# EAGLE design Launch Shield (EAGLE 6.5.0)
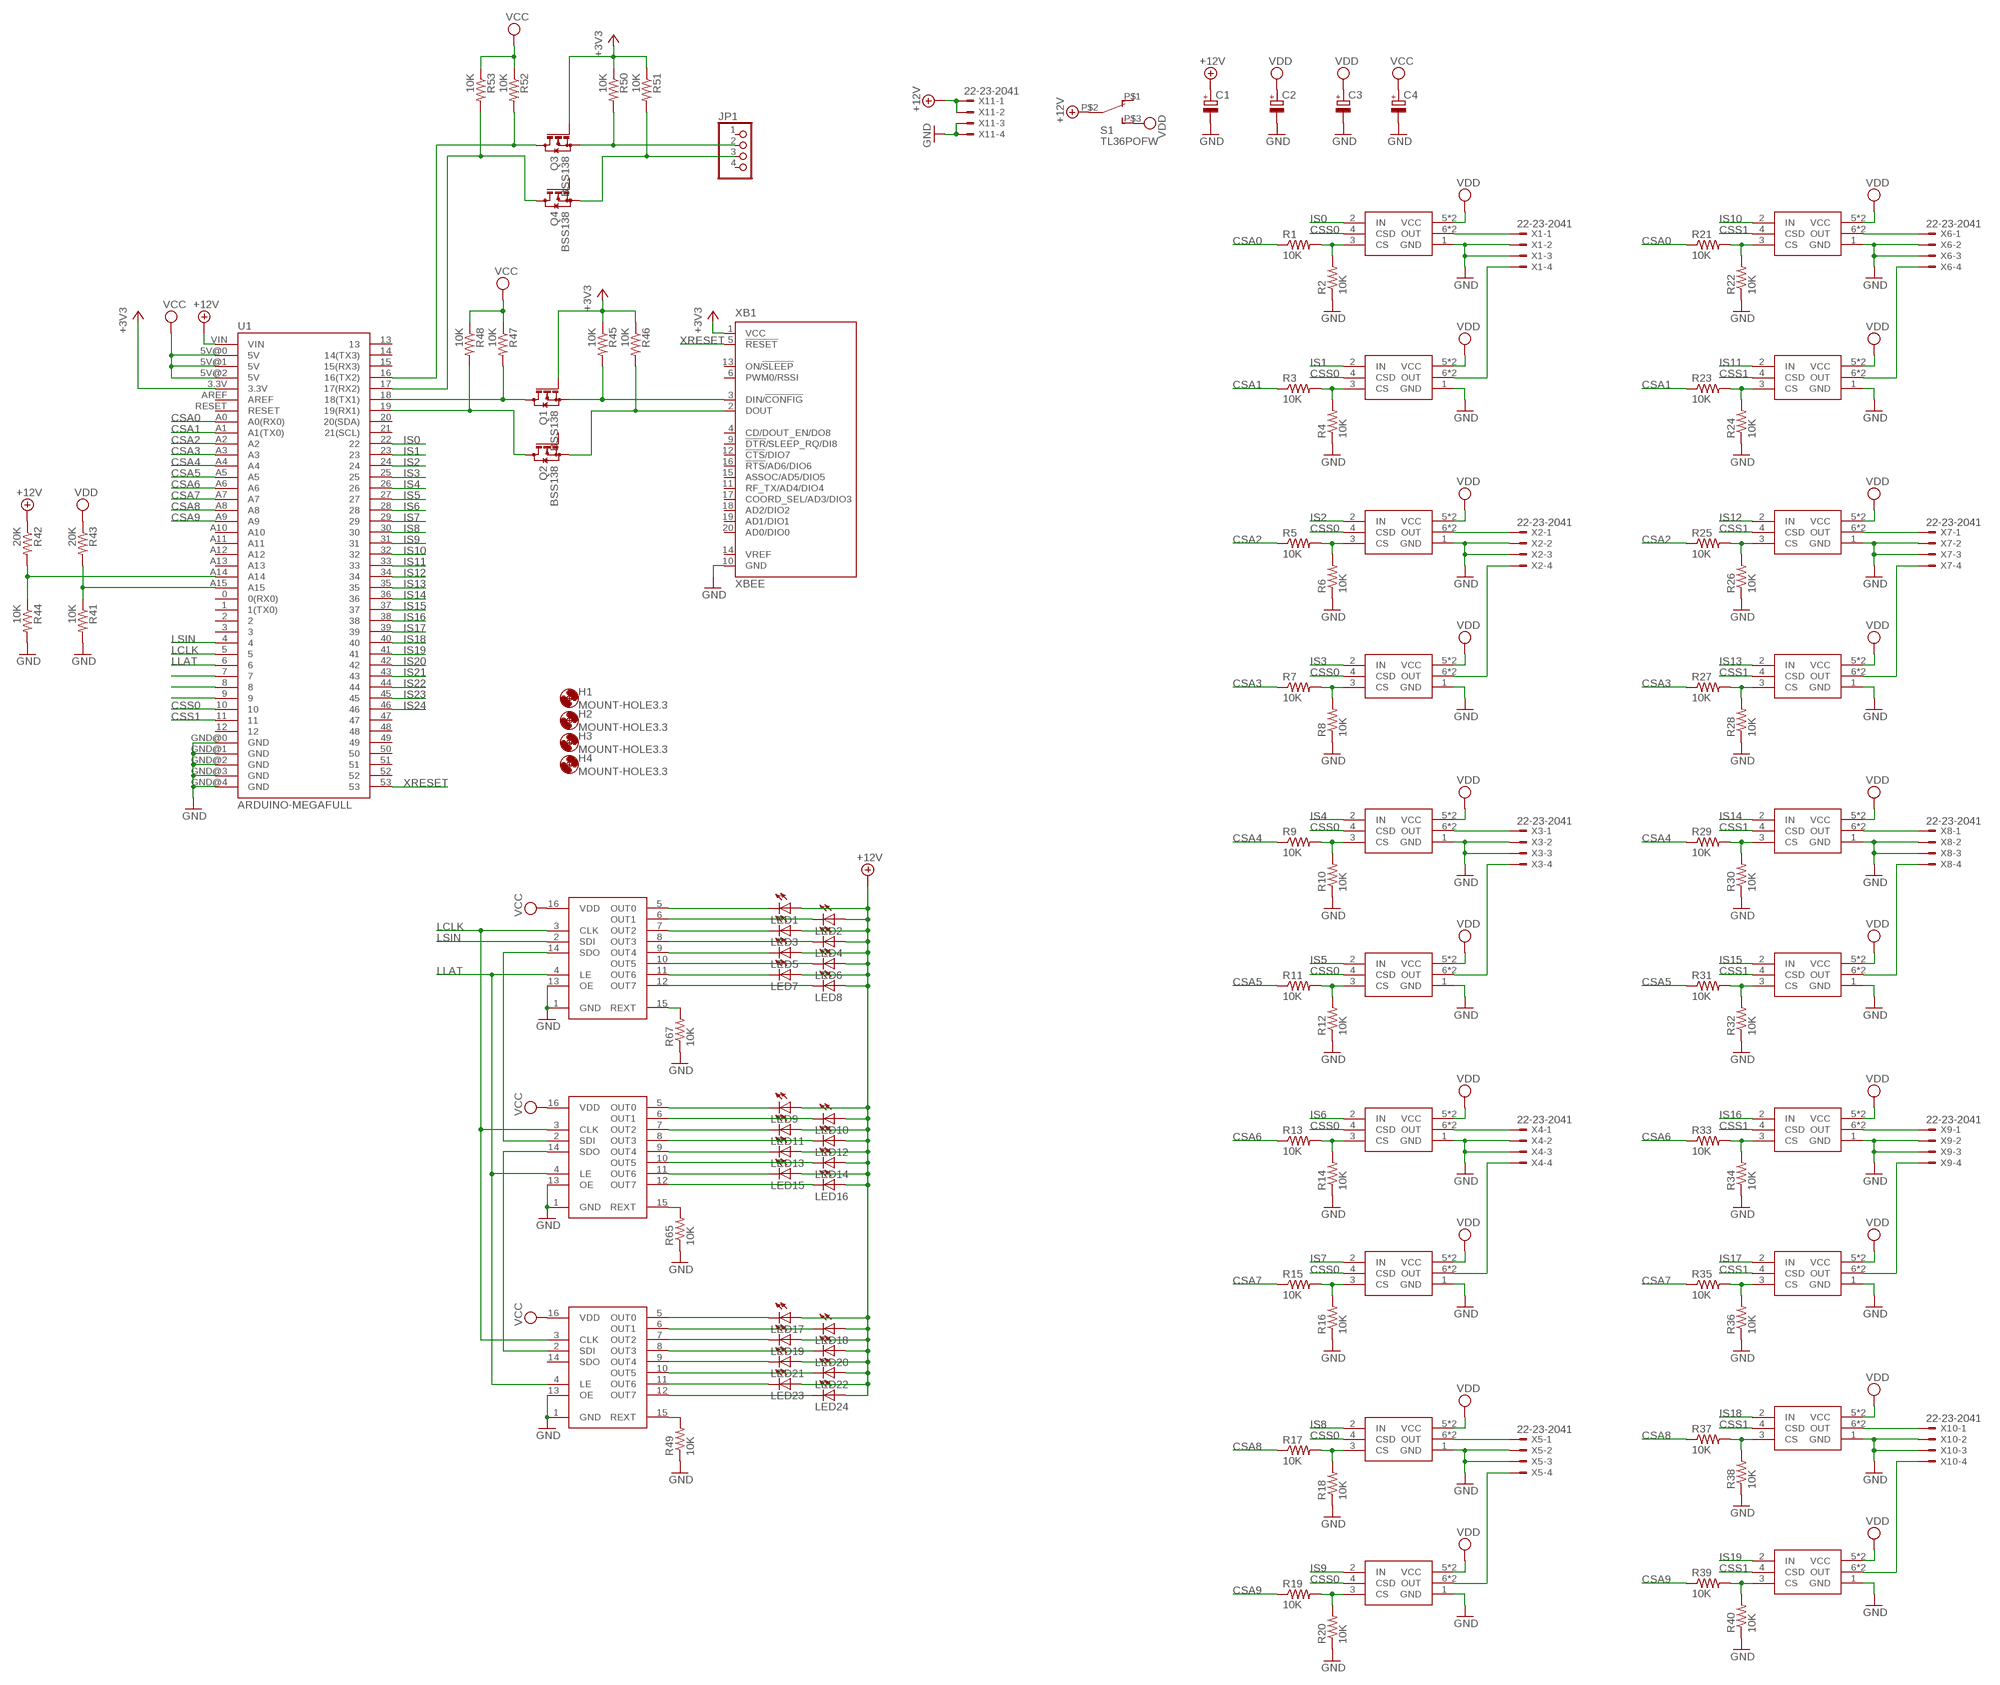
[diagram p0: schematic, sheet 1]

## Parts
C1  CPOL-EUE5-6  [E5-6]
C2  CPOL-EUE5-6  [E5-6]
C3  CPOL-EUE5-6  [E5-6]
C4  CPOL-EUE5-6  [E5-6]
H1  MOUNT-HOLE3.3  [3,3]
H2  MOUNT-HOLE3.3  [3,3]
H3  MOUNT-HOLE3.3  [3,3]
H4  MOUNT-HOLE3.3  [3,3]
JP1  PINHD-1X4  [1X04]
LED1  LEDCHIPLED_0805  [CHIPLED_0805]
LED2  LEDCHIPLED_0805  [CHIPLED_0805]
LED3  LEDCHIPLED_0805  [CHIPLED_0805]
LED4  LEDCHIPLED_0805  [CHIPLED_0805]
LED5  LEDCHIPLED_0805  [CHIPLED_0805]
LED6  LEDCHIPLED_0805  [CHIPLED_0805]
LED7  LEDCHIPLED_0805  [CHIPLED_0805]
LED8  LEDCHIPLED_0805  [CHIPLED_0805]
LED9  LEDCHIPLED_0805  [CHIPLED_0805]
LED10  LEDCHIPLED_0805  [CHIPLED_0805]
LED11  LEDCHIPLED_0805  [CHIPLED_0805]
LED12  LEDCHIPLED_0805  [CHIPLED_0805]
LED13  LEDCHIPLED_0805  [CHIPLED_0805]
LED14  LEDCHIPLED_0805  [CHIPLED_0805]
LED15  LEDCHIPLED_0805  [CHIPLED_0805]
LED16  LEDCHIPLED_0805  [CHIPLED_0805]
LED17  LEDCHIPLED_0805  [CHIPLED_0805]
LED18  LEDCHIPLED_0805  [CHIPLED_0805]
LED19  LEDCHIPLED_0805  [CHIPLED_0805]
LED20  LEDCHIPLED_0805  [CHIPLED_0805]
LED21  LEDCHIPLED_0805  [CHIPLED_0805]
LED22  LEDCHIPLED_0805  [CHIPLED_0805]
LED23  LEDCHIPLED_0805  [CHIPLED_0805]
LED24  LEDCHIPLED_0805  [CHIPLED_0805]
Q1  BSS138  BSS123  [SOT23]
Q2  BSS138  BSS123  [SOT23]
Q3  BSS138  BSS123  [SOT23]
Q4  BSS138  BSS123  [SOT23]
R1  10K  R-US_R0603  [R0603]
R2  10K  R-US_R0603  [R0603]
R3  10K  R-US_R0603  [R0603]
R4  10K  R-US_R0603  [R0603]
R5  10K  R-US_R0603  [R0603]
R6  10K  R-US_R0603  [R0603]
R7  10K  R-US_R0603  [R0603]
R8  10K  R-US_R0603  [R0603]
R9  10K  R-US_R0603  [R0603]
R10  10K  R-US_R0603  [R0603]
R11  10K  R-US_R0603  [R0603]
R12  10K  R-US_R0603  [R0603]
R13  10K  R-US_R0603  [R0603]
R14  10K  R-US_R0603  [R0603]
R15  10K  R-US_R0603  [R0603]
R16  10K  R-US_R0603  [R0603]
R17  10K  R-US_R0603  [R0603]
R18  10K  R-US_R0603  [R0603]
R19  10K  R-US_R0603  [R0603]
R20  10K  R-US_R0603  [R0603]
R21  10K  R-US_R0603  [R0603]
R22  10K  R-US_R0603  [R0603]
R23  10K  R-US_R0603  [R0603]
R24  10K  R-US_R0603  [R0603]
R25  10K  R-US_R0603  [R0603]
R26  10K  R-US_R0603  [R0603]
R27  10K  R-US_R0603  [R0603]
R28  10K  R-US_R0603  [R0603]
R29  10K  R-US_R0603  [R0603]
R30  10K  R-US_R0603  [R0603]
R31  10K  R-US_R0603  [R0603]
R32  10K  R-US_R0603  [R0603]
R33  10K  R-US_R0603  [R0603]
R34  10K  R-US_R0603  [R0603]
R35  10K  R-US_R0603  [R0603]
R36  10K  R-US_R0603  [R0603]
R37  10K  R-US_R0603  [R0603]
R38  10K  R-US_R0603  [R0603]
R39  10K  R-US_R0603  [R0603]
R40  10K  R-US_R0603  [R0603]
R41  10K  R-US_R0603  [R0603]
R42  20K  R-US_R0603  [R0603]
R43  20K  R-US_R0603  [R0603]
R44  10K  R-US_R0603  [R0603]
R45  10K  R-US_R0603  [R0603]
R46  10K  R-US_R0603  [R0603]
R47  10K  R-US_R0603  [R0603]
R48  10K  R-US_R0603  [R0603]
R49  10K  R-US_R0603  [R0603]
R50  10K  R-US_R0603  [R0603]
R51  10K  R-US_R0603  [R0603]
R52  10K  R-US_R0603  [R0603]
R53  10K  R-US_R0603  [R0603]
R65  10K  R-US_R0603  [R0603]
R67  10K  R-US_R0603  [R0603]
S1  TL36POFW  [TOGGLE]
U1  ARDUINO-MEGAFULL  [ARDUINO_MEGA]
U$1  VN5E160MS-E  [SOIC8]
U$2  VN5E160MS-E  [SOIC8]
U$3  VN5E160MS-E  [SOIC8]
U$4  VN5E160MS-E  [SOIC8]
U$5  VN5E160MS-E  [SOIC8]
U$6  VN5E160MS-E  [SOIC8]
U$7  VN5E160MS-E  [SOIC8]
U$8  VN5E160MS-E  [SOIC8]
U$9  VN5E160MS-E  [SOIC8]
U$10  VN5E160MS-E  [SOIC8]
U$11  VN5E160MS-E  [SOIC8]
U$12  VN5E160MS-E  [SOIC8]
U$13  VN5E160MS-E  [SOIC8]
U$14  VN5E160MS-E  [SOIC8]
U$15  VN5E160MS-E  [SOIC8]
U$16  VN5E160MS-E  [SOIC8]
U$17  VN5E160MS-E  [SOIC8]
U$18  VN5E160MS-E  [SOIC8]
U$19  VN5E160MS-E  [SOIC8]
U$20  VN5E160MS-E  [SOIC8]
U$21  TLC5916  [D_R-PDSO-G16]
U$22  TLC5916  [D_R-PDSO-G16]
U$23  TLC5916  [D_R-PDSO-G16]
X1  22-23-2041  [22-23-2041]
X2  22-23-2041  [22-23-2041]
X3  22-23-2041  [22-23-2041]
X4  22-23-2041  [22-23-2041]
X5  22-23-2041  [22-23-2041]
X6  22-23-2041  [22-23-2041]
X7  22-23-2041  [22-23-2041]
X8  22-23-2041  [22-23-2041]
X9  22-23-2041  [22-23-2041]
X10  22-23-2041  [22-23-2041]
X11  22-23-2041  [22-23-2041]
XB1  XBEE  [XBEE]

## Nets
+3V3: Q1.1(G) Q3.1(G) R45.1 R46.1 R50.1 R51.1 U1.3.3V XB1.1(VCC)
+12V: C1.+ LED1.A LED2.A LED3.A LED4.A LED5.A LED6.A LED7.A LED8.A LED9.A LED10.A LED11.A LED12.A LED13.A LED14.A LED15.A LED16.A LED17.A LED18.A LED19.A LED20.A LED21.A LED22.A LED23.A LED24.A R42.1 S1.P$2(P) U1.VIN X11.1 X11.2
CSA0: R1.1 R21.1 U1.A0(A0(RX0))
CSA1: R3.1 R23.1 U1.A1(A1(TX0))
CSA2: R5.1 R25.1 U1.A2
CSA3: R7.1 R27.1 U1.A3
CSA4: R9.1 R29.1 U1.A4
CSA5: R11.1 R31.1 U1.A5
CSA6: R13.1 R33.1 U1.A6
CSA7: R15.1 R35.1 U1.A7
CSA8: R17.1 R37.1 U1.A8
CSA9: R19.1 R39.1 U1.A9
CSS0: U1.10 U$1.4(CSD) U$2.4(CSD) U$3.4(CSD) U$4.4(CSD) U$5.4(CSD) U$6.4(CSD) U$7.4(CSD) U$8.4(CSD) U$9.4(CSD) U$10.4(CSD)
CSS1: U1.11 U$11.4(CSD) U$12.4(CSD) U$13.4(CSD) U$14.4(CSD) U$15.4(CSD) U$16.4(CSD) U$17.4(CSD) U$18.4(CSD) U$19.4(CSD) U$20.4(CSD)
GND: C1.- C2.- C3.- C4.- R2.1 R4.1 R6.1 R8.1 R10.1 R12.1 R14.1 R16.1 R18.1 R20.1 R22.1 R24.1 R26.1 R28.1 R30.1 R32.1 R34.1 R36.1 R38.1 R40.1 R41.2 R44.2 R49.1 R65.1 R67.1 U1.GND@0(GND) U1.GND@1(GND) U1.GND@2(GND) U1.GND@3(GND) U1.GND@4(GND) U$1.1(GND) U$2.1(GND) U$3.1(GND) U$4.1(GND) U$5.1(GND) U$6.1(GND) U$7.1(GND) U$8.1(GND) U$9.1(GND) U$10.1(GND) U$11.1(GND) U$12.1(GND) U$13.1(GND) U$14.1(GND) U$15.1(GND) U$16.1(GND) U$17.1(GND) U$18.1(GND) U$19.1(GND) U$20.1(GND) U$21.1(GND) U$21.13(OE) U$22.1(GND) U$22.13(OE) U$23.1(GND) U$23.13(OE) X1.2 X1.3 X2.2 X2.3 X3.2 X3.3 X4.2 X4.3 X5.2 X5.3 X6.2 X6.3 X7.2 X7.3 X8.2 X8.3 X9.2 X9.3 X10.2 X10.3 X11.3 X11.4 XB1.10(GND)
IS0: U1.22 U$1.2(IN)
IS1: U1.23 U$2.2(IN)
IS2: U1.24 U$3.2(IN)
IS3: U1.25 U$4.2(IN)
IS4: U1.26 U$5.2(IN)
IS5: U1.27 U$6.2(IN)
IS6: U1.28 U$7.2(IN)
IS7: U1.29 U$8.2(IN)
IS8: U1.30 U$9.2(IN)
IS9: U1.31 U$10.2(IN)
IS10: U1.32 U$11.2(IN)
IS11: U1.33 U$12.2(IN)
IS12: U1.34 U$13.2(IN)
IS13: U1.35 U$14.2(IN)
IS14: U1.36 U$15.2(IN)
IS15: U1.37 U$16.2(IN)
IS16: U1.38 U$17.2(IN)
IS17: U1.39 U$18.2(IN)
IS18: U1.40 U$19.2(IN)
IS19: U1.41 U$20.2(IN)
IS20: U1.42
IS21: U1.43
IS22: U1.44
IS23: U1.45
IS24: U1.46
LCLK: U1.5 U$21.3(CLK) U$22.3(CLK) U$23.3(CLK)
LLAT: U1.6 U$21.4(LE) U$22.4(LE) U$23.4(LE)
LSIN: U1.4 U$21.2(SDI)
N$1: U$1.6(OUT) U$1.7(OUT) X1.1
N$2: R1.2 R2.2 U$1.3(CS)
N$3: R3.2 R4.2 U$2.3(CS)
N$4: U$2.6(OUT) U$2.7(OUT) X1.4
N$5: R5.2 R6.2 U$3.3(CS)
N$6: U$10.6(OUT) U$10.7(OUT) X5.4
N$7: R7.2 R8.2 U$4.3(CS)
N$8: U$4.6(OUT) U$4.7(OUT) X2.4
N$9: R9.2 R10.2 U$5.3(CS)
N$10: U$5.6(OUT) U$5.7(OUT) X3.1
N$11: R11.2 R12.2 U$6.3(CS)
N$12: U$11.6(OUT) U$11.7(OUT) X6.1
N$13: R13.2 R14.2 U$7.3(CS)
N$14: U$12.6(OUT) U$12.7(OUT) X6.4
N$15: R15.2 R16.2 U$8.3(CS)
N$16: U$18.6(OUT) U$18.7(OUT) X9.4
N$17: R17.2 R18.2 U$9.3(CS)
N$18: R42.2 R44.1 U1.A14
N$19: R19.2 R20.2 U$10.3(CS)
N$20: R41.1 R43.2 U1.A15
N$21: R21.2 R22.2 U$11.3(CS)
N$22: Q2.2(S) R46.2 XB1.2(DOUT)
N$23: R23.2 R24.2 U$12.3(CS)
N$24: Q1.2(S) R45.2 XB1.3(DIN/!CONFIG)
N$25: R25.2 R26.2 U$13.3(CS)
N$26: U$13.6(OUT) U$13.7(OUT) X7.1
N$27: R27.2 R28.2 U$14.3(CS)
N$28: R49.2 U$23.15(REXT)
N$29: R29.2 R30.2 U$15.3(CS)
N$30: U$15.6(OUT) U$15.7(OUT) X8.1
N$31: R31.2 R32.2 U$16.3(CS)
N$32: U$14.6(OUT) U$14.7(OUT) X7.4
N$33: R33.2 R34.2 U$17.3(CS)
N$34: U$17.6(OUT) U$17.7(OUT) X9.1
N$35: R35.2 R36.2 U$18.3(CS)
N$36: Q1.3(D) R47.2 U1.18(18(TX1))
N$37: R37.2 R38.2 U$19.3(CS)
N$38: U$19.6(OUT) U$19.7(OUT) X10.1
N$39: R39.2 R40.2 U$20.3(CS)
N$40: U$16.6(OUT) U$16.7(OUT) X8.4
N$41: Q2.3(D) R48.2 U1.19(19(RX1))
N$42: R65.2 U$22.15(REXT)
N$43: R67.2 U$21.15(REXT)
N$44: U$3.6(OUT) U$3.7(OUT) X2.1
N$45: U$21.14(SDO) U$22.2(SDI)
N$46: U$22.14(SDO) U$23.2(SDI)
N$47: LED8.C U$21.12(OUT7)
N$48: LED7.C U$21.11(OUT6)
N$49: U$6.6(OUT) U$6.7(OUT) X3.4
N$50: LED6.C U$21.10(OUT5)
N$51: U$20.6(OUT) U$20.7(OUT) X10.4
N$52: U$7.6(OUT) U$7.7(OUT) X4.1
N$53: U$8.6(OUT) U$8.7(OUT) X4.4
N$54: U$9.6(OUT) U$9.7(OUT) X5.1
N$55: LED5.C U$21.9(OUT4)
N$56: LED4.C U$21.8(OUT3)
N$57: LED3.C U$21.7(OUT2)
N$58: LED2.C U$21.6(OUT1)
N$59: LED1.C U$21.5(OUT0)
N$60: LED9.C U$22.5(OUT0)
N$61: LED10.C U$22.6(OUT1)
N$62: LED11.C U$22.7(OUT2)
N$63: LED12.C U$22.8(OUT3)
N$64: LED13.C U$22.9(OUT4)
N$65: U1.7
N$66: U1.8
N$67: U1.9
N$68: LED14.C U$22.10(OUT5)
N$69: LED15.C U$22.11(OUT6)
N$70: LED16.C U$22.12(OUT7)
N$71: LED17.C U$23.5(OUT0)
N$72: LED18.C U$23.6(OUT1)
N$73: LED19.C U$23.7(OUT2)
N$74: LED20.C U$23.8(OUT3)
N$75: LED21.C U$23.9(OUT4)
N$76: LED22.C U$23.10(OUT5)
N$77: LED23.C U$23.11(OUT6)
N$78: LED24.C U$23.12(OUT7)
N$79: JP1.3 Q4.2(S) R51.2
N$80: JP1.2 Q3.2(S) R50.2
N$81: Q3.3(D) R52.2 U1.16(16(TX2))
N$82: Q4.3(D) R53.2 U1.17(17(RX2))
VCC: C4.+ R47.1 R48.1 R52.1 R53.1 U1.5V@0(5V) U1.5V@1(5V) U1.5V@2(5V) U$21.16(VDD) U$22.16(VDD) U$23.16(VDD)
VDD: C2.+ C3.+ R43.1 S1.P$3(S) U$1.5(VCC) U$1.8(VCC) U$2.5(VCC) U$2.8(VCC) U$3.5(VCC) U$3.8(VCC) U$4.5(VCC) U$4.8(VCC) U$5.5(VCC) U$5.8(VCC) U$6.5(VCC) U$6.8(VCC) U$7.5(VCC) U$7.8(VCC) U$8.5(VCC) U$8.8(VCC) U$9.5(VCC) U$9.8(VCC) U$10.5(VCC) U$10.8(VCC) U$11.5(VCC) U$11.8(VCC) U$12.5(VCC) U$12.8(VCC) U$13.5(VCC) U$13.8(VCC) U$14.5(VCC) U$14.8(VCC) U$15.5(VCC) U$15.8(VCC) U$16.5(VCC) U$16.8(VCC) U$17.5(VCC) U$17.8(VCC) U$18.5(VCC) U$18.8(VCC) U$19.5(VCC) U$19.8(VCC) U$20.5(VCC) U$20.8(VCC)
XRESET: U1.53 XB1.5(!RESET)
Unconnected: JP1.1 JP1.4 Q2.1(G) Q4.1(G) S1.P$1(O) U1.0(0(RX0)) U1.1(1(TX0)) U1.2 U1.3 U1.12 U1.13 U1.14(14(TX3)) U1.15(15(RX3)) U1.20(20(SDA)) U1.21(21(SCL)) U1.47 U1.48 U1.49 U1.50 U1.51 U1.52 U1.A10 U1.A11 U1.A12 U1.A13 U1.AREF U1.RESET U$23.14(SDO) XB1.4(CD/DOUT_EN/DO8) XB1.6(PWM0/RSSI) XB1.9(!DTR!/SLEEP_RQ/DI8) XB1.11(RF_TX/AD4/DIO4) XB1.12(!CTS!/DIO7) XB1.13(ON/!SLEEP) XB1.14(VREF) XB1.15(ASSOC/AD5/DIO5) XB1.16(!RTS!/AD6/DIO6) XB1.17(COORD_SEL/AD3/DIO3) XB1.18(AD2/DIO2) XB1.19(AD1/DIO1) XB1.20(AD0/DIO0)

## Library data of the parts
C1-C4 = rcl:CPOL-EU: POLARIZED CAPACITOR, European symbol
H1-H4 = holes:MOUNT-HOLE: MOUNTING HOLE with drill center marker
JP1 = pinhead:PINHD-1X4: PIN HEADER
LED1-LED24 = led:LED: LED OSRAM: - CHIPLED LG R971, LG N971, LY N971, LG Q971, LY Q971, LO R971, LY R971 LH N974, LH R974 LS Q976, LO Q976, LY Q976 LO Q996 - Hyper CHIPLED LW Q18S LB Q993, LB Q99A, LB R99A - SideLED LS A670, LO A670, LY A670, LG A670, LP A670 LB A673, LV A673, LT A673, LW A673 LH A674 LY A675 LS A676, LA A676, LO A676, LY A676, LW A676 LS A679, LY A679, LG A679 - Hyper Micro SIDELED® LS Y876, LA Y876, LO Y876, LY Y876 LT Y87S - SmartLED LW L88C, LW L88S LB L89C, LB L89S, LG L890 LS L89K, LO L89K, LY L89K LS L896, LA L896, LO L896, LY L896 - TOPLED LS T670, LO T670, LY T670, LG T670, LP T670 LSG T670, LSP T670, LSY T670, LOP T670, LYG T670 LG T671, LOG T671, LSG T671 LB T673, LV T673, LT T673, LW T673 LH T674 LS T676, LA T676, LO T676, LY T676, LB T676, LH T676, LSB T676, LW T676 LB T67C, LV T67C, LT T67C, LS T67K, LO T67K, LY T67K, LW E67C LS E67B, LA E67B, LO E67B, LY E67B, LB E67C, LV E67C, LT E67C LW T67C LS T679, LY T679, LG T679 LS T770, LO T770, LY T770, LG T770, LP T770 LB T773, LV T773, LT T773, LW T773 LH T774 LS E675, LA E675, LY E675, LS T675 LS T776, LA T776, LO T776, LY T776, LB T776 LHGB T686 LT T68C, LB T68C - Hyper Mini TOPLED® LB M676 - Mini TOPLED Santana® LG M470 LS M47K, LO M47K, LY M47K Source: http://www.osram.convergy.de LUXEON: - LUMILED® LXK2-PW12-R00, LXK2-PW12-S00, LXK2-PW14-U00, LXK2-PW14-V00 LXK2-PM12-R00, LXK2-PM12-S00, LXK2-PM14-U00 LXK2-PE12-Q00, LXK2-PE12-R00, LXK2-PE12-S00, LXK2-PE14-T00, LXK2-PE14-U00 LXK2-PB12-K00, LXK2-PB12-L00, LXK2-PB12-M00, LXK2-PB14-N00, LXK2-PB14-P00, LXK2-PB14-Q00 LXK2-PR12-L00, LXK2-PR12-M00, LXK2-PR14-Q00, LXK2-PR14-R00 LXK2-PD12-Q00, LXK2-PD12-R00, LXK2-PD12-S00 LXK2-PH12-R00, LXK2-PH12-S00 LXK2-PL12-P00, LXK2-PL12-Q00, LXK2-PL12-R00 Source: www.luxeon.com KINGBRIGHT: KA-3528ASYC Source: www.kingbright.com
Q1-Q4 = transistor-small-signal:BSS123: N-CHANNEL MOS FET
R1-R53 R65 R67 = resistor:R-US_: RESISTOR, American symbol
S1 = chris:TL36PO: TINY SWITCH ON - ON Source: http://www2.produktinfo.conrad.com/datenblaetter/700000-724999/705152-da-01-de-Subminiaturschalter_TL_36YO.pdf
U1 = SparkFun-Boards:ARDUINO-MEGA: Arduino Mega board footprint
U$1-U$20 = chris:VN5E160MS-E
U$21-U$23 = chris:TLC5916
X1-X11 = con-molex:22-23-2041: .100" (2.54mm) Center Header - 4 Pin; MF: MOLEX; MPN: 22-23-2041; OC_FARNELL: 1462920; OC_NEWARK: 38C0355
XB1 = maxstream:XBEE: XBee (TM) /XBee-PRO(TM) OEM RF Modules Source: MaxStream, Inc. xbee_productmanual.pdf; MPN: XBP24-Z7UIT-004; OC_FARNELL: 1751799; OC_NEWARK: 34R5507

## Board
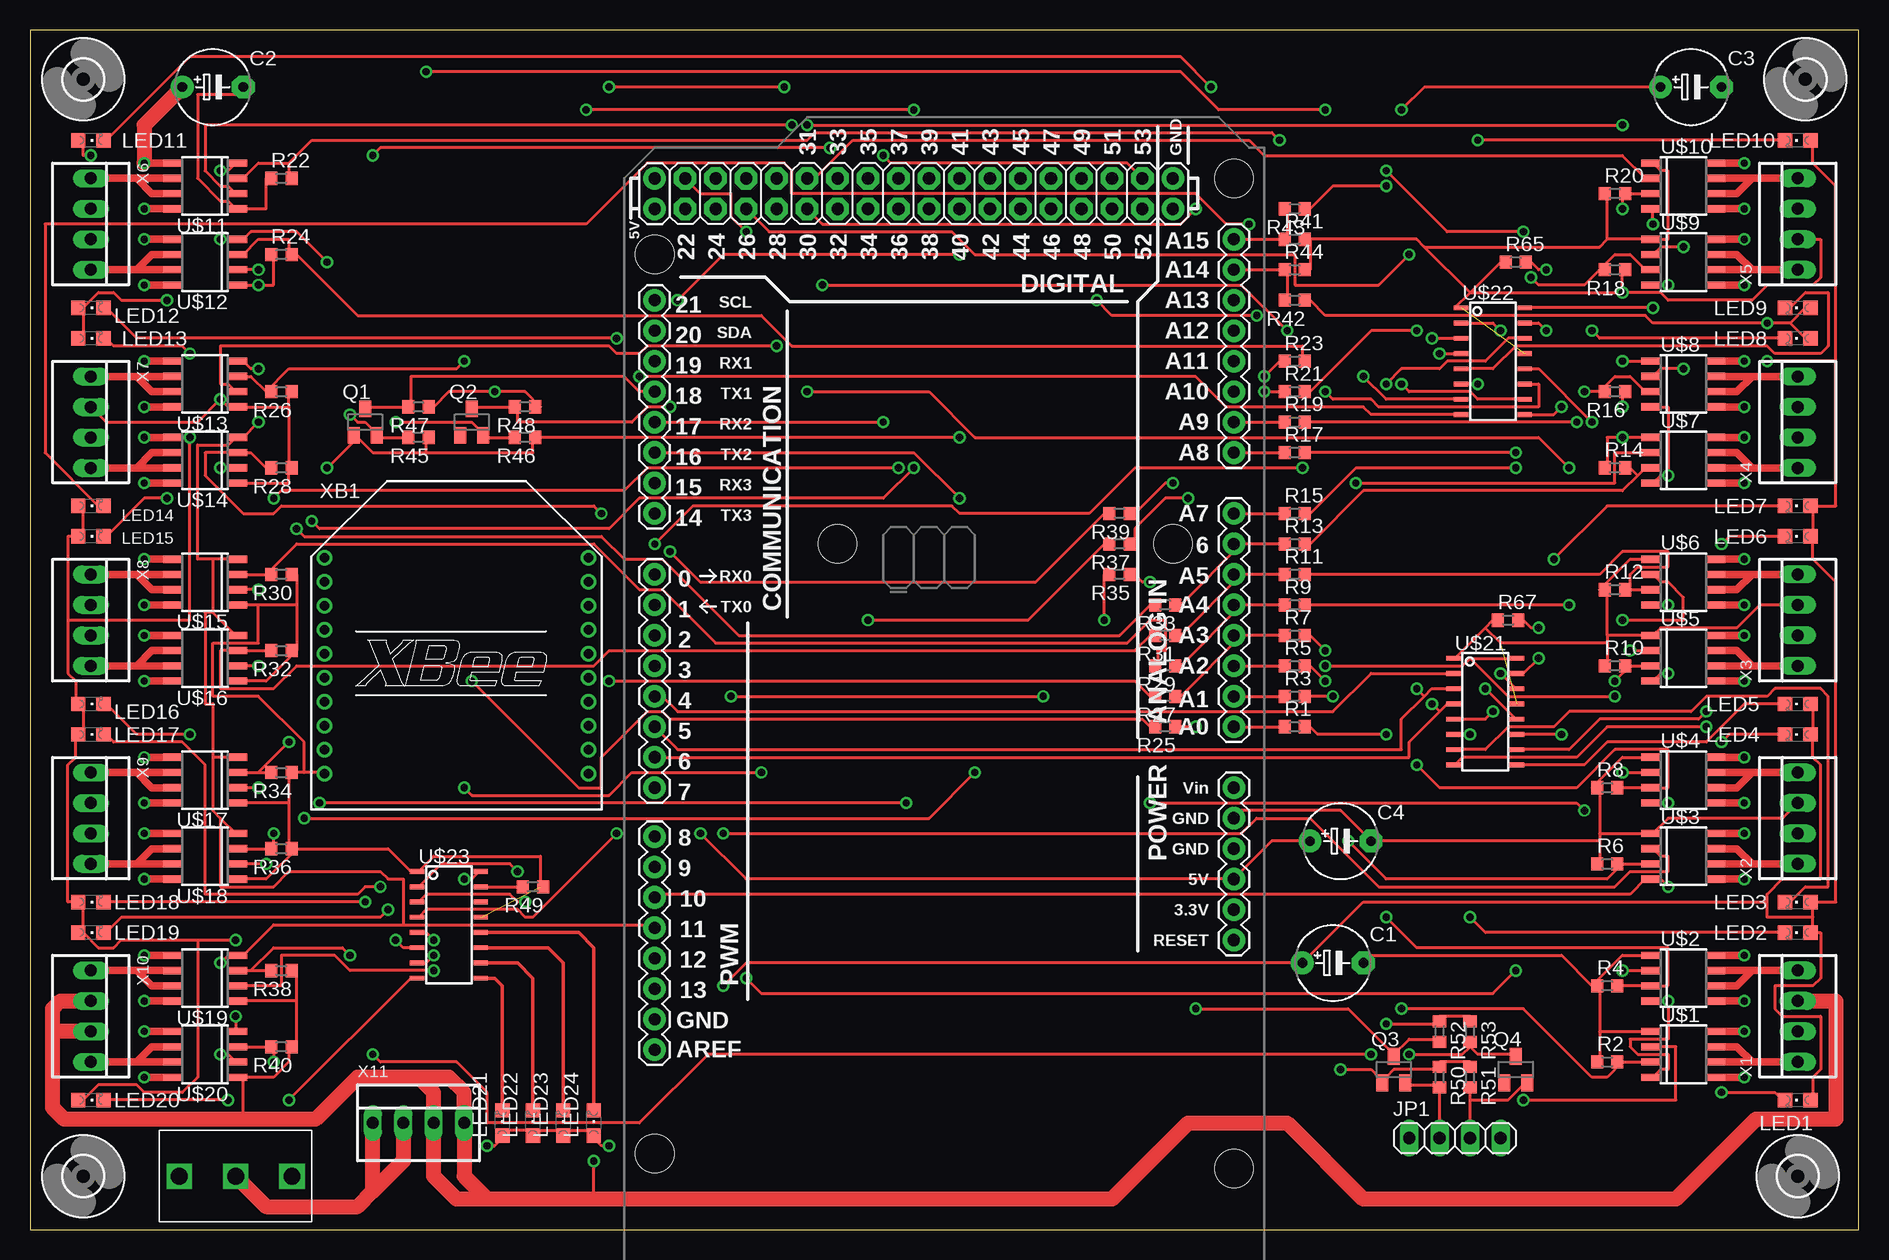
[diagram p1: board, top side]
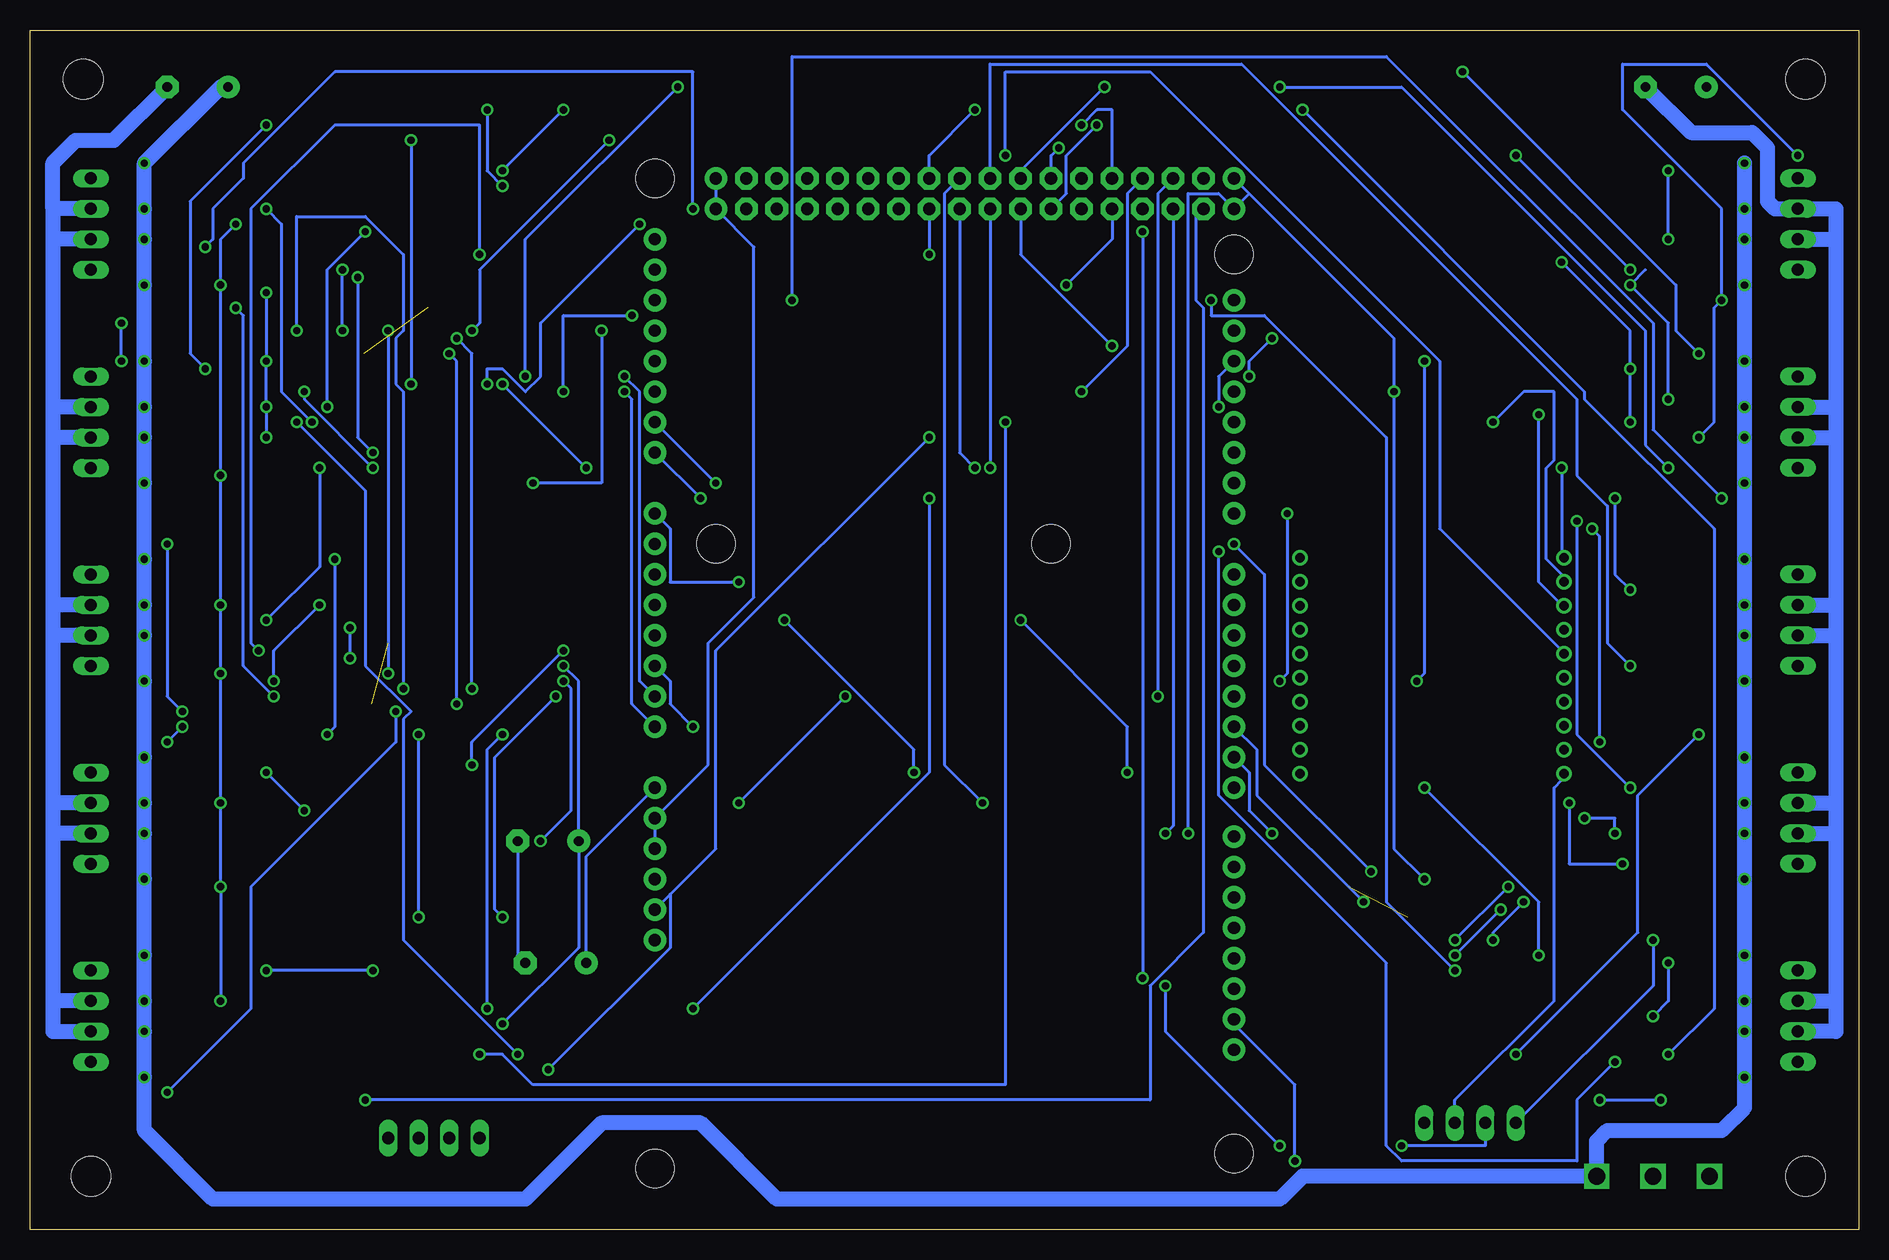
[diagram p2: board, bottom side, seen from below]

Size 152.39 x 100 mm. Coordinates in mm from the lower left corner, seen from the top.
Outline: 152.39,0 152.39,100 0,100 0,0 152.39,0
Copper layers (1*16): Top 0.035mm / dielectric 1.5mm / Bottom 0.035mm
Design rules "default": minimum track width 10mil, minimum drill 24mil, track to track 8mil, track to pad 8mil, pad to pad 8mil, via to via 8mil, smd to smd 8mil, copper to edge 40mil, drill to drill 8mil, minimum pad ring 10mil, minimum via ring 8mil, stop-mask expansion 4mil, vias tented up to drill 0mil, thermal gap 10mil

### Footprints (pad centres in the part's own frame; a part is rotated, then mirrored left to right if it is on the bottom)
E5-6 = drill 0.813 pad 1.905: + -2.54,0 | drill 0.813 pad 1.905 octagon: - 2.54,0
3,3 = hole 3.3: 0,0
1X04 = drill 1.016 long: 1 -3.81,0; 2 -1.27,0; 3 1.27,0; 4 3.81,0
CHIPLED_0805 = smd 1.2 x 1.2: A 0,-1.05; C 0,1.05
SOT23 = smd 1 x 1.4: 1 -0.95,-1.1; 2 0.95,-1.1; 3 0,1.1
R0603 = smd 1 x 1.1: 1 -0.85,0; 2 0.85,0
TOGGLE = drill 1.397 square: P$1 -4.699,0; P$2 0,0; P$3 4.699,0
ARDUINO_MEGA = drill 1.016 pad 1.88: 0 63.5,50.8; 1 60.96,50.8; 2 58.42,50.8; 3 55.88,50.8; 3.3V 35.56,2.54; 4 53.34,50.8; 5 50.8,50.8; 5V@0 38.1,2.54; 5V@1 93.98,50.8; 5V@2 96.52,50.8; 6 48.26,50.8; 7 45.72,50.8; 8 41.656,50.8; 9 39.116,50.8; 10 36.576,50.8; 11 34.036,50.8; 12 31.496,50.8; 13 28.956,50.8; 14 68.58,50.8; 15 71.12,50.8; 16 73.66,50.8; 17 76.2,50.8; 18 78.74,50.8; 19 81.28,50.8; 20 83.82,50.8; 21 86.36,50.8; A0 50.8,2.54; A1 53.34,2.54; A2 55.88,2.54; A3 58.42,2.54; A4 60.96,2.54; A5 63.5,2.54; A6 66.04,2.54; A7 68.58,2.54; A8 73.66,2.54; A9 76.2,2.54; A10 78.74,2.54; A11 81.28,2.54; A12 83.82,2.54; A13 86.36,2.54; A14 88.9,2.54; A15 91.44,2.54; AREF 23.876,50.8; GND@0 40.64,2.54; GND@1 43.18,2.54; GND@2 93.98,7.62; GND@3 96.52,7.62; GND@4 26.416,50.8; RESET 33.02,2.54; VIN 45.72,2.54 | drill 1.016 pad 1.88 octagon: 22 93.98,48.26; 23 96.52,48.26; 24 93.98,45.72; 25 96.52,45.72; 26 93.98,43.18; 27 96.52,43.18; 28 93.98,40.64; 29 96.52,40.64; 30 93.98,38.1; 31 96.52,38.1; 32 93.98,35.56; 33 96.52,35.56; 34 93.98,33.02; 35 96.52,33.02; 36 93.98,30.48; 37 96.52,30.48; 38 93.98,27.94; 39 96.52,27.94; 40 93.98,25.4; 41 96.52,25.4; 42 93.98,22.86; 43 96.52,22.86; 44 93.98,20.32; 45 96.52,20.32; 46 93.98,17.78; 47 96.52,17.78; 48 93.98,15.24; 49 96.52,15.24; 50 93.98,12.7; 51 96.52,12.7; 52 93.98,10.16; 53 96.52,10.16 | hole 3.2: 15.24,50.8; 13.97,2.54; 66.04,35.56; 66.04,7.62; 90.17,50.8; 96.52,2.54
SOIC8 = smd 0.6 x 1.5: 1 -1.905,-2.75; 2 -0.635,-2.75; 3 0.635,-2.75; 4 1.905,-2.75; 5 1.905,2.75; 6 0.635,2.75; 7 -0.635,2.75; 8 -1.905,2.75
D_R-PDSO-G16 = smd 0.4 x 1.2: 1 -4.445,-2.65; 2 -3.175,-2.65; 3 -1.905,-2.65; 4 -0.635,-2.65; 5 0.635,-2.65; 6 1.905,-2.65; 7 3.175,-2.65; 8 4.445,-2.65; 9 4.445,2.65; 10 3.175,2.65; 11 1.905,2.65; 12 0.635,2.65; 13 -0.635,2.65; 14 -1.905,2.65; 15 -3.175,2.65; 16 -4.445,2.65
22-23-2041 = drill 1 long: 1 -3.81,0; 2 -1.27,0; 3 1.27,0; 4 3.81,0
XBEE = drill 0.8 pad 1.27: 1 -11,9; 2 -11,7; 3 -11,5; 4 -11,3; 5 -11,1; 6 -11,-1; 7 -11,-3; 8 -11,-5; 9 -11,-7; 10 -11,-9; 11 11,-9; 12 11,-7; 13 11,-5; 14 11,-3; 15 11,-1; 16 11,1; 17 11,3; 18 11,5; 19 11,7; 20 11,9

### Placement (x,y rotation side)
C1  108.57,22.23 0 top
C2  15.23,95.25 0 top
C3  138.42,95.25 0 top
C4  109.21,32.38 0 top
H1  4.44,95.89 0 top
H2  4.44,4.45 0 top
H3  147.31,4.45 0 top
H4  147.95,95.89 0 top
JP1  118.73,7.62 0 top
LED1  147.31,10.79 90 top
LED2  147.31,24.77 90 top
LED3  147.31,27.3 90 top
LED4  147.31,41.27 90 top
LED5  147.31,43.81 90 top
LED6  147.31,57.78 90 top
LED7  147.31,60.33 90 top
LED8  147.31,74.3 90 top
LED9  147.31,76.83 90 top
LED10  147.31,90.81 90 top
LED11  5.07,90.81 270 top
LED12  5.07,76.83 270 top
LED13  5.07,74.3 270 top
LED14  5.07,60.33 270 top
LED15  5.07,57.78 270 top
LED16  5.07,43.81 270 top
LED17  5.07,41.27 270 top
LED18  5.07,27.3 270 top
LED19  5.07,24.77 270 top
LED20  5.07,10.79 270 top
LED21  39.36,8.89 0 top
LED22  41.9,8.89 0 top
LED23  44.44,8.89 0 top
LED24  46.98,8.89 0 top
Q1  27.93,67.31 0 top
Q2  36.82,67.31 0 top
Q3  113.66,13.34 0 top
Q4  123.81,13.34 0 top
R1  105.4,41.91 0 top
R2  131.44,13.97 0 top
R3  105.4,44.45 0 top
R4  131.44,20.32 0 top
R5  105.4,46.99 0 top
R6  131.44,30.48 0 top
R7  105.4,49.53 0 top
R8  131.44,36.83 0 top
R9  105.4,52.07 0 top
R10  132.07,46.99 0 top
R11  105.4,54.61 0 top
R12  132.07,53.34 0 top
R13  105.4,57.15 0 top
R14  132.07,63.5 0 top
R15  105.4,59.69 0 top
R16  132.07,69.85 180 top
R17  105.4,64.77 0 top
R18  132.07,80.01 180 top
R19  105.4,67.31 0 top
R20  132.07,86.36 0 top
R21  105.4,69.85 0 top
R22  20.94,87.63 0 top
R23  105.4,72.39 0 top
R24  20.94,81.28 0 top
R25  94.6,41.91 180 top
R26  20.94,69.85 180 top
R27  94.6,44.45 180 top
R28  20.94,63.5 180 top
R29  94.6,46.99 180 top
R30  20.94,54.61 180 top
R31  94.6,49.53 180 top
R32  20.94,48.26 180 top
R33  94.6,52.07 180 top
R34  20.94,38.1 180 top
R35  90.8,54.61 180 top
R36  20.94,31.75 180 top
R37  90.8,57.15 180 top
R38  20.94,21.59 180 top
R39  90.8,59.69 180 top
R40  20.94,15.24 180 top
R41  105.4,82.55 0 top
R42  105.4,77.47 180 top
R43  105.4,85.09 180 top
R44  105.4,80.01 0 top
R45  32.38,66.04 180 top
R46  41.27,66.04 180 top
R47  32.38,68.58 180 top
R48  41.27,68.58 180 top
R49  41.9,28.57 180 top
R50  117.46,12.7 270 top
R51  120,12.7 270 top
R52  117.46,16.51 270 top
R53  120,16.51 270 top
R65  123.81,80.64 0 top
R67  123.18,50.8 0 top
S1  17.13,4.45 0 top
U1  102.86,-8.89 90 top
U$1  137.78,14.61 270 top
U$2  137.78,20.95 270 top
U$3  137.78,31.11 270 top
U$4  137.78,37.47 270 top
U$5  137.78,47.62 270 top
U$6  137.78,53.98 270 top
U$7  137.78,64.14 270 top
U$8  137.78,70.48 270 top
U$9  137.78,80.64 270 top
U$10  137.78,87 270 top
U$11  14.6,87 90 top
U$12  14.6,80.64 90 top
U$13  14.6,70.48 90 top
U$14  14.6,64.14 90 top
U$15  14.6,53.98 90 top
U$16  14.6,47.62 90 top
U$17  14.6,37.47 90 top
U$18  14.6,31.11 90 top
U$19  14.6,20.95 90 top
U$20  14.6,14.61 90 top
U$21  121.27,43.18 270 top
U$22  121.91,72.39 270 top
U$23  34.91,25.4 270 top
X1  147.31,17.78 90 top
X2  147.31,34.29 90 top
X3  147.31,50.8 90 top
X4  147.31,67.31 90 top
X5  147.31,83.82 90 top
X6  5.07,83.82 270 top
X7  5.07,67.31 270 top
X8  5.07,50.8 270 top
X9  5.07,34.29 270 top
X10  5.07,17.78 270 top
X11  32.38,8.89 0 top
XB1  35.55,46.99 0 top

### Tracks (layer width: path | path; a pad name or v marks a point on that pad's centre or on a via)
+3V3  (via drill 0.61)
  Top 0.254: 33.01,64.77 33.01,66.04 R45.1 | 33.01,64.77 28.56,64.77 27.29,66.04 | 33.01,64.77 41.9,64.77 41.9,66.04 R46.1 v77.46,66.04 | 27.29,66.04 v24.75,63.5 | 27.29,66.04 Q1.1 | R51.1 120,13.97 117.46,13.97 R50.1 117.46,13.34 113.66,13.34 113.02,12.7 Q3.1 112.38,12.7 111.75,13.34 v109.21,13.34
  Bottom 0.254: v24.75,63.5 24.75,56.52 XB1.1 | v77.46,66.04 95.24,48.26 95.24,31.75 99.05,27.94 | U1.3.3V 99.05,27.94 | v109.21,13.34 99.05,23.5 99.05,27.94
+12V  (via drill 0.61)
  Top 0.254: 3.17,50.8 3.17,57.78 LED15.A 4.44,57.78 4.44,60.33 LED14.A | 3.17,50.8 3.17,46.35 3.8,45.72 3.8,43.81 LED16.A 4.44,43.81 4.44,41.27 LED17.A 3.8,41.27 3.8,39.37 3.17,38.73 3.17,27.3 LED18.A 4.44,27.3 4.44,24.77 | 41.9,8.26 39.36,8.26 LED21.A 39.36,7.62 38.73,6.99 v38.09,6.99 | 41.9,8.26 44.44,8.26 | 41.9,8.26 LED22.A | 44.44,8.26 46.98,8.26 LED24.A 46.98,7.62 47.62,6.99 v48.25,6.99 | 44.44,8.26 LED23.A | 13.96,24.13 13.96,12.7 12.69,11.43 9.52,11.43 8.88,12.06 5.71,12.06 4.44,10.79 LED20.A | 13.96,24.13 7.61,24.13 6.98,23.5 5.71,23.5 4.44,24.77 | 4.44,24.77 LED19.A | 13.96,24.13 v17.13,24.13 | v57.77,20.32 59.68,22.23 C1.+ 111.11,27.3 144.77,27.3 | 4.44,76.83 4.44,74.3 LED13.A | v5.07,89.53 4.44,89.53 4.44,90.81 LED11.A | v11.42,77.47 7.61,77.47 6.98,78.11 5.71,78.11 4.44,76.83 | 4.44,76.83 LED12.A | v13.33,66.04 13.33,50.8 3.17,50.8 | 146.68,75.56 v144.77,75.56 135.25,75.56 134.61,76.2 107.94,76.2 106.67,77.47 R42.1 | 146.68,75.56 147.95,76.83 LED9.A | 146.68,75.56 147.95,74.3 LED8.A | 148.58,60.33 148.58,57.78 | 150.49,72.39 150.49,60.33 148.58,60.33 | 150.49,72.39 150.49,87 148.58,88.9 148.58,90.81 LED10.A | 148.58,60.33 LED7.A | 148.58,41.27 148.58,43.81 LED5.A | 148.58,24.77 149.22,24.77 149.22,20.95 148.58,20.32 145.41,20.32 145.41,18.41 146.04,17.78 149.22,17.78 149.22,13.34 148.58,12.7 148.58,10.79 LED1.A | 148.58,24.77 148.58,26.04 | 148.58,26.04 148.58,27.3 | 148.58,24.77 LED2.A | 148.58,41.27 148.58,39.37 149.22,38.73 149.22,29.21 146.04,29.21 144.77,27.94 144.77,27.3 | 144.77,27.3 144.77,26.04 148.58,26.04 | 148.58,41.27 LED4.A | 148.58,57.78 148.58,55.88 150.49,53.98 150.49,27.3 148.58,27.3
  Top 0.254: 148.58,57.78 LED6.A | 148.58,27.3 LED3.A | 150.49,72.39 v144.77,72.39
  Top 1.27: S1.P$2 19.67,1.91 27.29,1.91 28.56,3.17 | 28.56,3.17 X11.1 | X11.2 31.1,5.71 28.56,3.17
  Bottom 0.254: U1.VIN 106.03,31.11 C1.+ | v38.09,6.99 31.1,6.99 X11.2 | X11.1 17.13,20.32 v17.13,24.13 | v48.25,6.99 57.77,16.51 v57.77,20.32 | v5.07,89.53 12.69,97.16 19.67,97.16 19.67,93.34 11.42,85.09 v11.42,77.47 12.05,76.83 12.05,67.31 v13.33,66.04 | v144.77,72.39 v144.77,75.56
CSA0  (via drill 0.61)
  Top 0.254: U1.A0 R1.1 | v102.86,69.85 R21.1
  Bottom 0.254: v102.86,69.85 102.22,69.22 102.22,43.81 U1.A0
CSA1  (via drill 0.61)
  Top 0.254: U1.A1 R3.1 | v102.86,71.12 104.13,72.39 R23.1
  Bottom 0.254: v102.86,71.12 101.59,69.85 101.59,45.72 U1.A1
CSA2  (via drill 0.61)
  Top 0.254: v97.14,41.91 R25.1 | U1.A2 R5.1
  Bottom 0.254: v97.14,41.91 99.05,43.81 99.05,45.72 U1.A2
CSA3
  Top 0.254: 100.95,49.53 95.88,44.45 R27.1 | R7.1 100.95,49.53 | 100.95,49.53 U1.A3
CSA4
  Top 0.254: 100.95,52.07 95.88,46.99 R29.1 | R9.1 100.95,52.07 | 100.95,52.07 U1.A4
CSA5
  Top 0.254: 100.95,54.61 95.88,49.53 R31.1 | R11.1 100.95,54.61 | 100.95,54.61 U1.A5
CSA6
  Top 0.254: 100.95,57.15 95.88,52.07 R33.1 | R13.1 100.95,57.15 | 100.95,57.15 U1.A6
CSA7  (via drill 0.61)
  Top 0.254: v93.33,53.98 92.7,53.98 92.06,54.61 R35.1 | U1.A7 R15.1
  Bottom 0.254: v93.33,53.98 99.05,53.98 99.05,58.42 U1.A7
CSA8  (via drill 0.61)
  Top 0.254: v96.51,60.96 94.6,60.96 92.06,58.42 92.06,57.15 R37.1 | U1.A8 R17.1
  Bottom 0.254: U1.A8 v96.51,60.96
CSA9  (via drill 0.61)
  Top 0.254: v95.24,62.23 94.6,62.23 92.06,59.69 R39.1 | U1.A9 R19.1
  Bottom 0.254: U1.A9 v95.24,62.23
CSS0  (via drill 0.61)
  Top 0.254: U1.10 52.06,27.94 133.34,27.94 134.61,29.21 U$3.4 135.88,29.21 v136.52,28.57 | U$2.4 v136.52,19.05 136.52,15.88 133.34,15.88 133.34,15.24 133.98,14.61 136.52,14.61 136.52,13.34 135.88,13.34 135.25,12.7 U$1.4 | U$8.4 136.52,68.58 v136.52,62.87 135.88,62.87 135.25,62.23 U$7.4 | v136.52,35.56 U$4.4 | v136.52,46.35 135.88,46.35 135.25,45.72 U$5.4 | v136.52,52.07 U$6.4 | v136.52,78.74 U$9.4 | v135.25,83.82 135.25,85.09 U$10.4
  Bottom 0.254: v135.25,83.82 136.52,82.55 v136.52,78.74 v136.52,62.87 v136.52,52.07 v136.52,46.35 v136.52,35.56 v136.52,28.57 v136.52,19.05
CSS1  (via drill 0.61)
  Top 0.254: v17.13,17.78 17.13,16.51 U$20.4 | v15.87,22.23 16.5,22.86 U$19.4 17.77,22.86 20.31,25.4 31.1,25.4 | 31.1,25.4 52.06,25.4 U1.11 | 15.87,34.29 15.23,34.92 15.23,39.37 | 15.87,34.29 17.13,33.02 U$18.4 | U$17.4 15.23,39.37 | 15.23,51.44 17.13,49.53 U$16.4 | 15.23,55.88 15.23,51.44 | U$15.4 15.23,55.88 | 15.23,55.88 13.96,55.88 13.96,65.41 16.5,65.41 17.13,66.04 U$14.4 17.77,66.04 v19.04,67.31 | v19.04,71.75 18.4,71.75 17.77,72.39 U$13.4 | v24.75,80.64 22.21,83.19 18.4,83.19 17.77,82.55 U$12.4 v15.87,82.55 | v15.87,88.27 16.5,88.27 17.13,88.9 U$11.4 | 15.23,39.37 15.23,43.81 14.6,43.81 14.6,51.44 15.23,51.44 | 31.1,25.4 31.1,29.21 29.83,29.21 29.2,29.84 21.58,29.84 20.31,28.57 15.87,28.57 15.87,34.29
  Bottom 0.254: v17.13,17.78 15.87,19.05 v15.87,22.23 | v19.04,67.31 v19.04,71.75 19.04,74.93 v24.75,80.64 | v15.87,82.55 v15.87,88.27
GND  (via drill 0.61)  (3 unrouted)
  Top 0.254: 130.8,16.51 130.8,20.32 R4.1 130.17,20.32 | 130.8,16.51 130.8,13.97 R2.1 | 130.8,16.51 U$1.1 | U$2.1 132.71,22.86 130.17,20.32 | U1.GND@1 100.95,34.92 109.21,34.92 C4.- 130.8,32.38 | 130.17,20.32 127.62,22.86 111.75,22.86 C1.- | R14.1 131.44,63.5 131.44,66.04 v132.71,66.04 U$7.1 135.25,66.04 | 135.25,72.39 U$8.1 v132.71,72.39 | v132.71,68.58 132.71,69.85 R16.1 | 131.44,82.55 131.44,86.36 R20.1 | 131.44,82.55 U$9.1 136.52,82.55 136.52,88.27 135.88,88.27 135.25,88.9 U$10.1 | 106.67,82.55 106.67,80.01 R44.2 | 120,78.11 118.73,76.83 U$22.1 | 120,78.11 122.55,80.64 R65.1 | v132.71,78.11 132.71,80.01 R18.1 | 120,78.11 v132.71,78.11 | 106.67,82.55 115.56,82.55 116.19,81.92 | 120,78.11 116.19,81.92 | 106.67,82.55 R41.2 | 131.44,82.55 130.8,81.92 116.19,81.92 | 121.27,50.16 118.73,47.62 U$21.1 | 121.27,50.16 121.91,50.8 R67.1 | 135.25,55.88 U$6.1 133.34,55.88 130.8,53.34 R12.1 131.44,53.34 131.44,49.53 | 131.44,49.53 131.44,48.9 | 131.44,48.9 131.44,46.99 R10.1 | 131.44,49.53 U$5.1 135.25,49.53 135.88,50.16 142.23,50.16 144.14,52.07 X3.3 | 121.27,50.16 122.55,48.9 131.44,48.9 | 135.25,39.37 U$4.1 132.71,39.37 130.17,36.83 R8.1 130.8,36.83 130.8,33.02 | 130.8,33.02 130.8,32.38 | 130.8,32.38 130.8,30.48 R6.1 | 130.8,33.02 U$3.1 135.25,33.02 136.52,34.29 146.04,34.29 X2.3 | 17.77,12.7 20.31,12.7 21.58,13.97 21.58,15.24 R40.1 22.21,15.24 22.21,19.05 | R49.1 42.54,28.57 42.54,31.11 33.65,31.11 32.38,29.84 U$23.1 31.74,29.84 29.83,31.75 22.21,31.75 | 21.58,35.56 21.58,38.1 R34.1 22.85,38.1 | 21.58,35.56 21.58,31.75 R36.1 22.21,31.75 | U$18.1 19.67,29.21 22.21,31.75 | 21.58,35.56 U$17.1 | U$12.1 v19.04,78.74 20.31,78.74 20.31,81.28 R24.1
  Top 0.254: R22.1 19.67,87.63 19.67,85.09 U$11.1 17.13,85.09 16.5,85.72 15.87,85.72 13.96,87.63 13.96,94.61 17.13,94.61 C2.- | 22.21,52.07 22.21,54.61 R30.1 | 22.21,52.07 22.21,48.26 | U$16.1 19.67,45.72 22.21,48.26 | 22.21,48.26 R32.1 | 22.21,52.07 19.04,52.07 | 19.04,52.07 U$15.1 | 21.58,63.5 21.58,62.23 U$14.1 | 21.58,68.58 21.58,69.85 R26.1 | 21.58,68.58 U$13.1 16.5,68.58 v15.87,69.22 13.96,67.31 6.34,67.31 X7.2 | 21.58,68.58 21.58,63.5 | 21.58,63.5 R28.1 | 22.85,38.1 24.12,38.1 XB1.10 | 19.04,52.07 19.04,48.9 15.23,48.9 15.23,44.45 19.04,44.45 22.85,40.64 22.85,38.1 | 22.21,19.05 22.21,21.59 R38.1 | 22.21,19.05 U$19.1 | v132.71,78.11 135.88,78.11 136.52,77.47 143.5,77.47 144.77,78.74 148.58,78.74 149.22,79.38 149.22,82.55 X5.2 | 46.98,2.54 v46.98,5.71 | 17.77,9.21 17.77,12.7 | 17.77,12.7 U$20.1
  Top 1.27: 32.38,12.7 33.65,11.43 X11.3 33.65,4.45 35.55,2.54 38.09,2.54 | 32.38,12.7 27.29,12.7 23.8,9.21 17.77,9.21 2.85,9.21 1.9,10.16 1.9,16.51 | 1.9,16.51 1.9,18.41 2.53,19.05 X10.2 | X10.3 1.9,16.51 | X1.3 150.49,19.05 150.49,9.21 143.82,9.21 137.15,2.54 111.11,2.54 104.77,8.89 96.51,8.89 90.16,2.54 46.98,2.54 38.09,2.54 | 32.38,12.7 34.91,12.7 36.19,11.43 X11.4 36.19,4.45 38.09,2.54
  Bottom 0.254: U1.GND@3 U1.GND@2 92.06,81.92 92.06,52.7 95.88,48.9 95.88,38.73 U1.GND@1 U1.GND@0 | C1.- 111.75,22.86 C4.- | v132.71,66.04 v132.71,68.58 v132.71,72.39 v132.71,78.11 | 17.77,80.01 v19.04,78.74 15.87,75.56 v15.87,69.22 | v46.98,5.71 46.98,12.06 52.06,17.14 U1.GND@4 | X11.3 33.65,10.79 25.39,19.05 25.39,36.83 24.75,37.47 XB1.10
  Bottom 1.27: 1.9,82.55 1.9,85.09 X6.2 6.98,85.09 7.61,85.72 7.61,90.17 8.88,91.44 13.96,91.44 C2.- | 1.9,82.55 1.9,68.58 | 1.9,68.58 1.9,66.04 | 1.9,66.04 1.9,52.07 | 1.9,52.07 1.9,49.53 | 1.9,49.53 1.9,35.56 | 1.9,35.56 1.9,33.02 | 1.9,33.02 1.9,19.05 | 1.9,19.05 1.9,16.51 X10.3 | X6.3 1.9,82.55 | X7.2 1.9,68.58 | X7.3 1.9,66.04 | X8.2 1.9,52.07 | X8.3 1.9,49.53 | X9.2 1.9,35.56 | X9.3 1.9,33.02 | X10.2 1.9,19.05 | X5.3 150.49,85.09 | 150.49,85.09 150.49,82.55 | 150.49,82.55 150.49,68.58 | 150.49,68.58 150.49,66.04 | 150.49,66.04 150.49,52.07 | 150.49,52.07 150.49,49.53 | 150.49,49.53 150.49,35.56 | 150.49,35.56 150.49,33.02 | 150.49,33.02 150.49,19.05 | 150.49,19.05 150.49,16.51 X1.2 | X1.3 150.49,19.05 | X2.3 150.49,35.56 | X2.2 150.49,33.02 | X3.3 150.49,52.07 | X3.2 150.49,49.53 | X4.2 150.49,66.04 | X4.3 150.49,68.58 | X5.2 150.49,82.55 | 150.49,85.09 150.49,88.9 148.58,90.81 145.41,90.81 C3.-
IS0  (via drill 0.61)
  Top 0.254: U$1.2 137.15,15.24 137.15,10.79 v124.45,10.79
  Bottom 0.254: v124.45,10.79 59.05,10.79 59.05,20.32 54.6,24.77 54.6,76.83 55.23,77.47 55.23,84.45 U1.22
IS1  (via drill 0.61)
  Top 0.254: v132.71,21.59 U$2.2 | v123.81,21.59 121.91,19.68 60.95,19.68 v59.68,20.95 | v59.68,83.19 58.41,84.45 58.41,86.36 55.87,86.36 U1.23
  Bottom 0.254: v123.81,21.59 v132.71,21.59 | v59.68,83.19 v59.68,20.95
IS2  (via drill 0.61)
  Top 0.254: v57.77,33.02 100.95,33.02 102.22,34.29 106.67,34.29 112.38,28.57 132.07,28.57 133.34,29.84 136.52,29.84 136.52,31.11 135.88,31.11 135.25,31.75 U$3.2
  Bottom 0.254: v57.77,33.02 57.14,33.66 U1.24
IS3  (via drill 0.61)
  Top 0.254: v132.71,38.1 U$4.2 | v129.53,34.92 128.9,35.56 v93.33,35.56 | v58.41,44.45 v84.44,44.45
  Bottom 0.254: v129.53,34.92 v132.71,38.1 | v84.44,44.45 v93.33,35.56 | v58.41,44.45 58.41,86.36 U1.25
IS4  (via drill 0.61)
  Top 0.254: v133.34,48.26 U$5.2 | v114.92,81.28 112.38,78.74 105.4,78.74 105.4,81.28 78.73,81.28 76.82,83.19 61.59,83.19 U1.26
  Bottom 0.254: v133.34,48.26 133.98,48.9 133.98,85.09 126.99,92.08 114.92,92.08 v114.92,81.28
IS5  (via drill 0.61)
  Top 0.254: v132.71,50.8 137.78,50.8 137.78,52.7 136.52,53.98 135.88,53.98 135.25,54.61 U$6.2 | v128.26,63.5 125.72,66.04 78.73,66.04 74.92,69.85 v64.76,69.85
  Bottom 0.254: v132.71,50.8 128.26,55.24 v128.26,63.5 | v64.76,69.85 60.95,73.66 60.95,86.36 U1.27
IS6  (via drill 0.61)
  Top 0.254: U$7.2 132.07,64.77 132.07,62.23 v110.48,62.23 | v104.77,74.93 100.95,78.74 v66.03,78.74
  Bottom 0.254: v110.48,62.23 104.77,62.23 v104.77,74.93 | v66.03,78.74 62.22,82.55 U1.28
IS7  (via drill 0.61)
  Top 0.254: v137.78,71.75 135.88,71.75 135.25,71.12 U$8.2 | v64.76,92.08 v132.71,92.08
  Bottom 0.254: v137.78,71.75 139.06,73.03 139.06,85.72 v132.71,92.08 | v64.76,92.08 63.49,93.34 62.22,93.34 U1.29
IS8  (via drill 0.61)
  Top 0.254: v137.78,81.92 135.88,81.92 135.25,81.28 U$9.2 | v97.14,85.09 95.88,83.82 66.03,83.82 U1.30
  Bottom 0.254: v137.78,81.92 137.15,82.55 137.15,85.09 134.61,87.63 134.61,88.9 126.99,96.52 97.14,96.52 v97.14,85.09
IS9
  Top 0.254: U1.31 65.39,87.63 68.57,90.81 101.59,90.81 102.86,89.53 132.71,89.53 134.61,87.63 U$10.2
IS10  (via drill 0.61)
  Top 0.254: v63.49,92.08 14.6,92.08 14.6,88.27 15.87,87 16.5,87 17.13,86.36 U$11.2
  Bottom 0.254: v63.49,92.08 66.03,89.53 66.03,86.36 U1.32
IS11  (via drill 0.61)
  Top 0.254: v19.04,80.01 U$12.2 | v28.56,89.53 29.2,90.17 v66.66,90.17
  Bottom 0.254: v28.56,89.53 v19.04,80.01 | v66.66,90.17 67.3,89.53 U1.33
IS12  (via drill 0.61)
  Top 0.254: v62.22,73.66 51.43,73.66 50.79,73.03 48.89,73.03 48.25,73.66 15.87,73.66 15.87,70.48 16.5,70.48 17.13,69.85 U$13.2
  Bottom 0.254: v62.22,73.66 69.84,81.28 U1.34
IS13  (via drill 0.61)
  Top 0.254: v15.87,63.5 U$14.2 | v62.86,95.25 v48.25,95.25
  Bottom 0.254: v15.87,63.5 17.77,65.41 17.77,74.93 38.09,95.25 v48.25,95.25 | v62.86,95.25 69.84,88.27 U1.35
IS14  (via drill 0.61)
  Top 0.254: v19.04,53.34 U$15.2 | v20.31,60.96 20.94,61.59 49.52,61.59 51.43,63.5 v72.38,63.5
  Bottom 0.254: v19.04,53.34 20.31,54.61 v20.31,60.96 | U1.36 v72.38,63.5
IS15  (via drill 0.61)
  Top 0.254: v19.04,46.99 U$16.2
  Bottom 0.254: v19.04,46.99 20.94,48.9 20.94,60.33 23.48,62.87 23.48,69.22 51.43,97.16 72.38,97.16 U1.37
IS16  (via drill 0.61)
  Top 0.254: v19.04,36.83 U$17.2 | v23.48,59.05 24.12,58.42 48.25,58.42 50.79,60.96 71.11,60.96 v73.65,63.5
  Bottom 0.254: v19.04,36.83 23.48,41.27 v23.48,59.05 | v73.65,63.5 74.92,64.77 U1.38
IS17  (via drill 0.61)
  Top 0.254: v19.67,30.48 U$18.2 | v73.02,35.56 v24.12,35.56
  Bottom 0.254: v19.67,30.48 24.12,30.48 v24.12,35.56 | v73.02,35.56 76.19,38.73 76.19,86.36 U1.39
IS18  (via drill 0.61)
  Top 0.254: U$19.2 20.94,20.32 20.94,22.86 25.39,22.86 26.66,21.59 v33.65,21.59 | v53.97,77.47 57.77,81.28 v77.46,81.28
  Bottom 0.254: v33.65,21.59 39.36,27.3 39.36,66.04 49.52,76.2 53.97,76.2 v53.97,77.47 | U1.40 v77.46,81.28
IS19  (via drill 0.61)
  Top 0.254: v15.87,14.61 16.5,14.61 17.13,13.97 U$20.2 | v73.65,93.34 v46.34,93.34
  Bottom 0.254: v15.87,14.61 12.05,18.41 12.05,58.42 22.85,69.22 22.85,69.85 v46.34,93.34 | v73.65,93.34 77.46,89.53 U1.41
LCLK  (via drill 0.61)
  Top 0.254: v41.27,27.3 40.63,27.3 40,27.94 33.01,27.94 32.38,27.3 U$23.3 | U$21.3 116.83,45.09 116.19,44.45 | 116.19,44.45 114.29,42.55 114.29,40.01 53.97,40.01 U1.5 | v116.83,74.3 U$22.3 | 116.19,44.45 v115.56,45.09
  Bottom 0.254: v41.27,27.3 50.16,36.2 50.16,40.01 U1.5 | v116.83,74.3 115.56,73.03 v115.56,45.09
LLAT  (via drill 0.61)
  Top 0.254: v48.89,33.02 41.9,26.04 41.27,26.04 40.63,26.67 33.01,26.67 32.38,26.04 U$23.4 | 117.46,43.18 114.92,40.64 114.92,39.37 U1.6 | 117.46,43.18 118.1,43.81 U$21.4 | v117.46,73.03 U$22.4 | 117.46,43.18 v116.83,43.81
  Bottom 0.254: v48.89,33.02 50.79,34.92 50.79,38.1 U1.6 | v117.46,73.03 116.83,72.39 v116.83,43.81
LSIN
  Top 0.254: U$21.2 111.75,46.35 108.57,43.18 53.97,43.18 52.7,44.45 U1.4
N$1
  Top 0.254: 140.96,15.24 U$1.7 | 140.96,13.97 U$1.6
  Top 0.61: 140.96,13.97 143.5,13.97 | 143.5,13.97 X1.1 | U$1.7 142.23,15.24 143.5,13.97
N$2  (via drill 0.61)
  Top 0.254: v113.02,41.27 107.3,41.27 106.67,41.91 R1.2 | v114.29,18.41 124.45,18.41 130.17,12.7 131.44,12.7 132.71,13.97 | 132.71,13.97 U$1.3 | 132.71,13.97 R2.2
  Bottom 0.254: v113.02,41.27 114.29,40.01 v114.29,18.41
N$3  (via drill 0.61)
  Top 0.254: v108.57,44.45 R3.2 | v113.02,26.04 115.56,23.5 136.52,23.5 136.52,20.32 U$2.3 R4.2
  Bottom 0.254: v108.57,44.45 113.66,39.37 113.66,26.67 v113.02,26.04
N$4
  Top 0.254: 140.96,20.32 U$2.6
  Top 0.61: X1.4 143.5,21.59 | 143.5,21.59 U$2.7 | 140.96,20.32 142.23,20.32 143.5,21.59
N$5  (via drill 0.61)
  Top 0.254: v107.94,45.72 106.67,46.99 R5.2 | v109.84,32.38 113.02,29.21 131.44,29.21 132.71,30.48 | 132.71,30.48 U$3.3 | 132.71,30.48 R6.2
  Bottom 0.254: v107.94,45.72 107.3,45.09 107.3,34.92 v109.84,32.38
N$6
  Top 0.254: 140.96,86.36 U$10.6 | 140.96,87.63 U$10.7
  Top 0.61: X5.4 143.5,87.63 | 143.5,87.63 U$10.7 | U$10.6 142.23,86.36 143.5,87.63
N$7  (via drill 0.61)
  Top 0.254: R8.2 U$4.3 136.52,36.83 136.52,40.01 132.07,40.01 128.9,36.83 117.46,36.83 v115.56,38.73 | v107.94,48.26 106.67,49.53 R7.2
  Bottom 0.254: v107.94,48.26 115.56,40.64 v115.56,38.73
N$8
  Top 0.254: 140.96,36.83 U$4.6
  Top 0.61: X2.4 143.5,38.1 | 143.5,38.1 U$4.7 | 140.96,36.83 142.23,36.83 143.5,38.1
N$9  (via drill 0.61)
  Top 0.254: v128.26,52.07 R9.2 | 133.34,46.99 v132.07,45.72 | 133.34,46.99 U$5.3 | 133.34,46.99 R10.2
  Bottom 0.254: v128.26,52.07 132.07,48.26 v132.07,45.72
N$10
  Top 0.61: X3.1 143.5,46.99 | 143.5,46.99 U$5.6 | U$5.7 142.23,48.26 143.5,46.99
N$11
  Top 0.254: R11.2 130.8,54.61 132.71,56.52 136.52,56.52 136.52,55.24 133.98,55.24 133.34,54.61 133.34,53.34 | 133.34,53.34 U$6.3 | 133.34,53.34 R12.2
N$12
  Top 0.61: U$11.6 8.88,87.63 | 8.88,87.63 X6.1 | U$11.7 10.15,86.36 8.88,87.63
N$13
  Top 0.254: 133.98,62.87 134.61,63.5 U$7.3 | 133.98,62.87 132.71,61.59 111.11,61.59 106.67,57.15 R13.2 | 133.98,62.87 133.34,63.5 R14.2
N$14
  Top 0.61: X6.4 8.88,80.01 | 8.88,80.01 U$12.7 | U$12.6 10.15,81.28 8.88,80.01
N$15  (via drill 0.61)
  Top 0.254: v123.81,63.5 110.48,63.5 106.67,59.69 R15.2 | 130.8,69.85 v129.53,69.85 | 130.8,69.85 132.07,71.12 133.34,71.12 134.61,69.85 U$8.3 | 130.8,69.85 R16.2
  Bottom 0.254: v123.81,63.5 129.53,69.22 v129.53,69.85
N$16
  Top 0.254: 12.05,30.48 U$18.7 | 12.05,31.75 U$18.6
  Top 0.61: X9.4 8.88,30.48 | 8.88,30.48 U$18.7 | 12.05,31.75 10.15,31.75 8.88,30.48
N$17  (via drill 0.61)
  Top 0.254: v123.81,64.77 R17.2 | v125.08,79.38 125.72,78.74 129.53,78.74 130.8,80.01 | 130.8,80.01 132.07,81.28 133.34,81.28 134.61,80.01 U$9.3 | 130.8,80.01 R18.2
  Bottom 0.254: v123.81,64.77 125.08,66.04 v125.08,79.38
N$18
  Top 0.254: R42.2 104.77,77.47 104.77,80.01 R44.1 U1.A14
N$19  (via drill 0.61)
  Top 0.254: v128.9,67.31 R19.2 | v132.71,85.09 132.71,86.36 R20.2 U$10.3
  Bottom 0.254: v128.9,67.31 131.44,69.85 131.44,83.82 v132.71,85.09
N$20
  Top 0.254: R43.2 104.77,85.09 104.77,82.55 R41.1 U1.A15
N$21  (via drill 0.61)
  Top 0.254: 21.58,88.9 21.58,87.63 R22.2 | 21.58,88.9 19.04,88.9 17.77,87.63 U$11.3 | v115.56,74.93 111.75,74.93 106.67,69.85 R21.2 | v104.13,90.81 103.49,91.44 65.39,91.44 64.76,90.81 23.48,90.81 21.58,88.9
  Bottom 0.254: v115.56,74.93 114.92,75.56 114.92,80.01 v104.13,90.81
N$22  (via drill 0.61)
  Top 0.254: R46.2 38.09,66.04 Q2.2 37.46,66.67 36.82,67.31 v30.47,67.31
  Bottom 0.254: v30.47,67.31 27.93,69.85 25.39,69.85 25.39,64.14 26.02,63.5 26.02,55.88 24.75,54.61 XB1.2
N$23
  Top 0.254: U$12.3 17.77,81.28 19.04,82.55 21.58,82.55 21.58,81.28 R24.2 22.21,81.28 27.29,76.2 60.95,76.2 63.49,73.66 106.03,73.66 106.03,72.39 R23.2
N$24  (via drill 0.61)
  Top 0.254: R45.2 29.2,66.04 Q1.2 28.56,66.67 27.93,67.31 27.29,67.31 v26.66,67.94
  Bottom 0.254: v26.66,67.94 26.66,53.98 24.75,52.07 XB1.3
N$25  (via drill 0.61)
  Top 0.254: 19.67,69.85 18.4,71.12 U$13.3 | v36.82,45.72 45.71,36.83 47.62,36.83 47.62,39.37 51.43,43.18 52.7,43.18 53.33,42.55 92.7,42.55 93.33,41.91 R25.2 | v36.19,72.39 35.55,71.75 21.58,71.75 19.67,69.85 | 19.67,69.85 R26.2
  Bottom 0.254: v36.82,45.72 36.19,46.35 v36.19,72.39
N$26
  Top 0.61: X7.1 8.88,71.12 | 8.88,71.12 U$13.6 | U$13.7 10.15,69.85 8.88,71.12
N$27  (via drill 0.61)
  Top 0.254: R28.2 19.67,63.5 18.4,64.77 U$14.3 14.6,64.77 14.6,62.87 17.77,59.69 20.31,59.69 20.94,60.33 46.98,60.33 v47.62,59.69 | v48.25,45.72 92.06,45.72 93.33,44.45 R27.2
  Bottom 0.254: v48.25,45.72 47.62,46.35 v47.62,59.69
N$28
  Top 0.254: U$23.15 R49.2
N$29
  Top 0.254: U$15.3 19.67,54.61 | 19.67,54.61 22.21,57.15 46.98,57.15 50.79,53.34 52.7,53.34 57.14,48.9 91.43,48.9 93.33,50.8 94.6,50.8 94.6,48.26 93.97,48.26 93.97,46.99 R29.2 | 19.67,54.61 R30.2
N$30
  Top 0.254: 12.05,53.34 U$15.7 | 12.05,54.61 U$15.6
  Top 0.61: X8.1 8.88,54.61 | 8.88,54.61 U$15.6 | 12.05,53.34 10.15,53.34 8.88,54.61
N$31
  Top 0.254: R32.2 U$16.3 15.87,48.26 15.87,45.09 20.31,45.09 22.21,46.99 46.98,46.99 48.25,48.26 92.06,48.26 93.33,49.53 R31.2
N$32
  Top 0.61: U$14.7 8.88,63.5 | 8.88,63.5 X7.4 | U$14.6 10.15,64.77 8.88,63.5
N$33  (via drill 0.61)
  Top 0.254: U$17.3 19.04,38.1 | 19.04,38.1 R34.2 | v22.21,58.42 22.85,57.78 47.62,57.78 49.52,55.88 52.7,55.88 59.05,49.53 90.8,49.53 93.33,52.07 R33.2 | 19.04,38.1 v21.58,40.64
  Bottom 0.254: v22.21,58.42 21.58,57.78 v21.58,40.64
N$34
  Top 0.254: 12.05,36.83 U$17.7 | 12.05,38.1 U$17.6
  Top 0.61: X9.1 8.88,38.1 | 8.88,38.1 U$17.6 | 12.05,36.83 10.15,36.83 8.88,38.1
N$35  (via drill 0.61)
  Top 0.254: U$18.3 R36.2 20.31,31.75 v20.31,33.02 | v89.52,50.8 89.52,54.61 R35.2 | v78.73,38.1 74.92,34.29 v22.85,34.29
  Bottom 0.254: v89.52,50.8 78.73,40.01 v78.73,38.1 | v22.85,34.29 20.31,34.29 v20.31,33.02
N$36
  Top 0.254: Q1.3 27.93,68.58 R47.2 31.74,68.58 31.74,71.12 49.52,71.12 50.79,69.85 U1.18
N$37  (via drill 0.61)
  Top 0.254: U$19.3 18.4,21.59 | 18.4,21.59 R38.2 | v69.84,50.8 83.17,50.8 89.52,57.15 R37.2 | v60.95,38.1 50.16,38.1 48.25,36.2 36.82,36.2 v36.19,36.83 | v26.66,22.86 26.02,23.5 20.31,23.5 18.4,21.59
  Bottom 0.254: v69.84,50.8 60.95,41.91 v60.95,38.1 | v36.19,36.83 26.66,27.3 v26.66,22.86
N$38
  Top 0.254: 12.05,20.32 U$19.7 | 12.05,21.59 U$19.6
  Top 0.61: X10.1 8.88,21.59 | 8.88,21.59 U$19.6 | U$19.7 10.15,20.32 8.88,21.59
N$39  (via drill 0.61)
  Top 0.254: U$20.3 R40.2 20.31,15.24 v20.31,13.97 | v53.33,56.52 55.87,53.98 83.81,53.98 89.52,59.69 R39.2
  Bottom 0.254: v53.33,56.52 53.33,36.2 39.36,22.23 39.36,6.99 38.09,5.71 23.48,5.71 23.48,10.79 v20.31,13.97
N$40
  Top 0.254: 12.05,48.26 U$16.6 | 12.05,46.99 U$16.7
  Top 0.61: X8.4 8.88,46.99 | 8.88,46.99 U$16.7 | 12.05,48.26 10.15,48.26 8.88,46.99
N$41  (via drill 0.61)
  Top 0.254: Q2.3 36.82,68.58 R48.2 40.63,68.58 40.63,67.31 50.16,67.31 51.43,68.58 v53.33,68.58
  Bottom 0.254: v53.33,68.58 53.33,71.12 U1.19
N$42  (via drill 0.61)
  Top 0.254: v126.35,80.01 125.72,80.01 125.08,80.64 R65.2 | v126.35,74.93 125.72,75.56 U$22.15
  Bottom 0.254: v126.35,74.93 v126.35,80.01
N$43  (via drill 0.61)
  Top 0.254: v125.72,50.16 125.08,50.16 124.45,50.8 R67.2 | v125.72,47.62 124.45,46.35 U$21.15
  Bottom 0.254: v125.72,47.62 v125.72,50.16
N$44
  Top 0.254: 140.96,31.75 U$3.7 | 140.96,30.48 U$3.6
  Top 0.61: X2.1 143.5,30.48 | 143.5,30.48 U$3.6 | U$3.7 142.23,31.75 143.5,30.48
N$45  (via drill 0.61)
  Top 0.254: v122.55,46.35 123.81,45.09 U$21.14 | v122.55,74.93 121.91,75.56 U$22.2
  Bottom 0.254: v122.55,74.93 v122.55,46.35
N$46  (via drill 0.61)
  Top 0.254: v40.63,29.84 40,30.48 34.28,30.48 32.38,28.57 U$23.2 | v52.06,57.15 55.23,60.33 76.82,60.33 77.46,59.69 88.25,59.69 92.06,63.5 v106.03,63.5 | v113.02,70.48 114.29,71.75 117.46,71.75 118.1,72.39 121.27,72.39 123.18,74.3 U$22.14
  Bottom 0.254: v40.63,29.84 49.52,38.73 49.52,54.61 v52.06,57.15 | v113.02,70.48 v106.03,63.5
N$47  (via drill 0.61)
  Top 0.254: v121.27,45.09 123.81,42.55 U$21.12 | v130.17,74.93 130.8,74.3 LED8.C
  Bottom 0.254: v121.27,45.09 121.27,69.85 121.91,70.48 121.91,74.3 121.27,74.93 121.27,81.28 124.45,84.45 130.17,84.45 v130.17,74.93
N$48  (via drill 0.61)
  Top 0.254: v127.62,41.27 U$21.11 | v126.99,55.88 131.44,60.33 LED7.C
  Bottom 0.254: v127.62,41.27 126.99,41.91 v126.99,55.88
N$49
  Top 0.61: X3.4 143.5,54.61 | 143.5,54.61 U$6.7 | U$6.6 142.23,53.34 143.5,54.61
N$50  (via drill 0.61)
  Top 0.254: U$21.10 128.26,40.01 130.8,42.55 139.06,42.55 v139.69,43.18 | v140.96,57.15 141.59,57.78 LED6.C
  Bottom 0.254: v139.69,43.18 140.96,44.45 v140.96,57.15
N$51
  Top 0.254: 12.05,13.97 U$20.7 | 12.05,15.24 U$20.6
  Top 0.61: U$20.7 8.88,13.97 | 8.88,13.97 X10.4 | 12.05,15.24 10.15,15.24 8.88,13.97
N$52
  Top 0.254: 140.96,64.77 U$7.7 | 140.96,63.5 U$7.6
  Top 0.61: X4.1 143.5,63.5 | 143.5,63.5 U$7.6 | U$7.7 142.23,64.77 143.5,63.5
N$53
  Top 0.254: 140.96,69.85 U$8.6
  Top 0.61: X4.4 143.5,71.12 | 143.5,71.12 U$8.7 | 140.96,69.85 142.23,69.85 143.5,71.12
N$54
  Top 0.254: 140.96,81.28 U$9.7 | 140.96,80.01 U$9.6
  Top 0.61: X5.1 143.5,80.01 | 143.5,80.01 U$9.6 | U$9.7 142.23,81.28 143.5,80.01
N$55
  Top 0.254: U$21.9 129.53,38.73 131.44,40.64 139.69,40.64 142.87,43.81 LED5.C
N$56  (via drill 0.61)
  Top 0.254: v139.69,41.91 131.44,41.91 128.9,39.37 119.37,39.37 118.73,38.73 U$21.8 | v140.96,40.64 141.59,41.27 LED4.C
  Bottom 0.254: v140.96,40.64 v139.69,41.91
N$57
  Top 0.254: U$21.7 121.27,40.01 123.18,41.91 126.99,41.91 128.26,43.18 138.42,43.18 139.69,44.45 144.77,44.45 145.41,45.09 149.22,45.09 149.85,44.45 149.85,28.57 147.95,28.57 146.68,27.3 LED3.C
N$58  (via drill 0.61)
  Top 0.254: v120,41.27 U$21.6 | v120,26.04 121.27,24.77 LED2.C
  Bottom 0.254: v120,26.04 v120,41.27
N$59  (via drill 0.61)
  Top 0.254: v140.96,11.43 145.41,11.43 146.04,10.79 LED1.C | v121.91,43.18 121.27,42.55 U$21.5
  Bottom 0.254: v140.96,11.43 133.98,18.41 133.98,28.57 121.91,40.64 v121.91,43.18
N$60
  Top 0.254: U$22.5 121.91,71.75 123.81,73.66 144.77,73.66 145.41,73.03 149.22,73.03 149.85,73.66 149.85,78.11 147.95,78.11 146.68,76.83 LED9.C
N$61  (via drill 0.61)
  Top 0.254: v120.64,70.48 U$22.6 | LED10.C v120.64,90.81
  Bottom 0.254: v120.64,90.81 v120.64,70.48
N$62  (via drill 0.61)
  Top 0.254: v98.41,95.25 95.88,97.79 13.33,97.79 6.34,90.81 LED11.C | v111.11,71.12 113.02,69.22 U$22.7
  Bottom 0.254: v98.41,95.25 111.11,82.55 v111.11,71.12
N$63  (via drill 0.61)
  Top 0.254: v48.89,74.3 8.88,74.3 6.34,76.83 LED12.C | v50.79,71.12 97.14,71.12 99.68,68.58 111.11,68.58 111.75,67.94 U$22.8
  Bottom 0.254: v48.89,74.3 50.79,72.39 v50.79,71.12
N$64  (via drill 0.61)
  Top 0.254: v13.33,73.03 12.69,73.66 6.98,73.66 6.34,74.3 LED13.C | v33.01,96.52 95.88,96.52 99.05,93.34 v107.94,93.34 | v113.02,88.27 118.1,83.19 v124.45,83.19 | v127.62,68.58 126.99,67.94 U$22.9
  Bottom 0.254: v13.33,73.03 15.23,74.93 15.23,78.74 v33.01,96.52 | v113.02,88.27 v107.94,93.34 | v124.45,83.19 127.62,80.01 v127.62,68.58
N$68  (via drill 0.61)
  Top 0.254: v101.59,83.82 99.68,83.82 97.14,86.36 63.49,86.36 63.49,88.27 62.86,88.9 51.43,88.9 46.34,83.82 1.26,83.82 1.26,64.77 5.71,60.33 LED14.C | v114.29,70.48 114.92,69.85 120,69.85 120.64,69.22 U$22.10
  Bottom 0.254: v101.59,83.82 109.84,75.56 109.84,71.12 111.11,69.85 113.02,71.75 114.29,71.75 v114.29,70.48
N$69  (via drill 0.61)
  Top 0.254: v11.42,60.96 9.52,60.96 6.34,57.78 LED15.C | v88.89,77.47 90.16,76.2 v102.22,76.2 | v107.94,69.85 108.57,69.22 111.75,69.22 112.38,68.58 125.72,68.58 125.72,70.48 U$22.11
  Bottom 0.254: v11.42,60.96 17.13,66.67 17.13,75.56 39.36,97.79 88.89,97.79 v88.89,77.47 | v102.22,76.2 107.94,76.2 v107.94,69.85
N$70  (via drill 0.61)
  Top 0.254: v13.33,41.27 8.88,41.27 6.34,43.81 LED16.C | v28.56,14.61 29.2,13.97 35.55,13.97 38.09,11.43 38.09,8.89 50.79,8.89 56.51,14.61 v111.75,14.61 | v130.17,67.31 125.72,71.75 U$22.12
  Bottom 0.254: v13.33,41.27 18.4,36.2 18.4,24.77 v28.56,14.61 | v111.75,14.61 121.27,24.13 121.27,42.55 120.64,43.18 124.45,46.99 124.45,61.59 v130.17,67.31
N$71  (via drill 0.61)
  Top 0.254: v29.2,28.57 27.93,28.57 27.29,27.94 14.6,27.94 14.6,38.73 12.69,40.64 6.98,40.64 6.34,41.27 LED17.C | v33.65,24.13 33.01,24.77 U$23.5
  Bottom 0.254: v33.65,24.13 v29.2,28.57
N$72  (via drill 0.61)
  Top 0.254: v27.93,27.3 LED18.C | v30.47,24.13 31.1,23.5 U$23.6
  Bottom 0.254: v27.93,27.3 30.47,24.77 v30.47,24.13
N$73  (via drill 0.61)
  Top 0.254: v29.83,26.67 29.2,26.04 7.61,26.04 6.34,24.77 LED19.C | v33.65,22.86 33.01,22.23 U$23.7
  Bottom 0.254: v33.65,22.86 v29.83,26.67
N$74  (via drill 0.61)
  Top 0.254: v16.5,10.79 LED20.C | v21.58,10.79 31.74,20.95 U$23.8
  Bottom 0.254: v21.58,10.79 v16.5,10.79
N$75
  Top 0.305: LED21.C 39.36,20.32 38.73,20.95 U$23.9
N$76
  Top 0.305: LED22.C 41.9,20.95 40.63,22.23 U$23.10
N$77
  Top 0.305: LED23.C 44.44,22.23 43.17,23.5 U$23.11
N$78
  Top 0.305: LED24.C 46.98,23.5 45.71,24.77 U$23.12
N$79
  Top 0.254: JP1.3 120,10.79 | 120,10.79 R51.2 | 120,10.79 123.18,10.79 124.45,12.06 Q4.2
N$80
  Top 0.254: Q3.2 114.92,12.06 117.46,12.06 R50.2 JP1.2
N$81  (via drill 0.61)
  Top 0.254: 113.66,14.61 114.92,15.88 117.46,15.88 R52.2 | 113.66,14.61 109.84,18.41 v97.14,18.41 | v77.46,60.96 73.65,64.77 U1.16 | 113.66,14.61 Q3.3
  Bottom 0.254: v97.14,18.41 77.46,38.1 v77.46,60.96
N$82  (via drill 0.61)
  Top 0.254: 120,15.24 120.64,14.61 123.81,14.61 Q4.3 | 120,15.24 119.37,14.61 v114.92,14.61 | U1.17 v71.11,67.31 | 120,15.24 R53.2
  Bottom 0.254: v114.92,14.61 113.02,14.61 110.48,12.06 71.11,12.06 v71.11,67.31
VCC  (via drill 0.61)
  Top 0.254: R47.1 33.65,68.58 34.91,69.85 v38.73,69.85 41.27,69.85 42.54,68.58 R48.1 | v36.19,29.21 36.82,29.21 37.46,29.84 U$23.16 | C4.+ 103.49,32.38 U1.5V@0 59.68,29.21 v55.87,33.02 | R53.1 120,17.78 117.46,17.78 R52.1 117.46,17.14 v113.02,17.14 | 120,47.62 U$21.16 | 120,47.62 119.37,46.99 v107.94,46.99 | v135.25,76.83 U$22.16 | v132.07,44.45 123.18,44.45 120,47.62
  Bottom 0.254: v36.19,29.21 38.73,31.75 v38.73,69.85 38.73,74.3 50.79,86.36 | U1.5V@2 50.79,86.36 | 50.79,86.36 U1.5V@1 53.33,86.36 55.87,86.36 v55.87,33.02 | v107.94,46.99 106.67,45.72 C4.+ 106.67,23.5 v113.02,17.14 | v135.25,76.83 134.61,76.2 134.61,46.99 v132.07,44.45
VDD  (via drill 0.6, 0.61)
  Top 0.254: v113.02,87 108.57,87 106.67,85.09 R43.1 | v114.29,93.34 116.19,95.25 C3.+
  Top 0.61: U$20.8 v9.52,12.7 | U$20.5 v9.52,16.51 | U$19.8 v9.52,19.05 | U$19.5 v9.52,22.86 | U$18.8 v9.52,29.21 | U$18.5 v9.52,33.02 | U$17.8 v9.52,35.56 | U$17.5 v9.52,39.37 | U$11.5 v9.52,88.9 | U$11.8 v9.52,85.09 | U$12.5 v9.52,82.55 | U$12.8 v9.52,78.74 | U$13.5 v9.52,72.39 | U$13.8 v9.52,68.58 | U$14.5 v9.52,66.04 | U$14.8 v9.52,62.23 | U$15.5 v9.52,55.88 | U$15.8 v9.52,52.07 | U$16.5 v9.52,49.53 | U$16.8 v9.52,45.72 | U$1.5 v142.87,12.7 | U$1.8 v142.87,16.51 | U$2.5 v142.87,19.05 | U$2.8 v142.87,22.86 | U$3.5 v142.87,29.21 | U$3.8 v142.87,33.02 | U$4.5 v142.87,35.56 | U$4.8 v142.87,39.37 | U$5.5 v142.87,45.72 | U$5.8 v142.87,49.53 | U$6.5 v142.87,52.07 | U$6.8 v142.87,55.88 | U$7.5 v142.87,62.23 | U$7.8 v142.87,66.04 | U$8.5 v142.87,68.58 | U$8.8 v142.87,72.39 | U$10.8 v142.87,88.9 | v142.87,78.74 U$9.5 140.33,78.74 | 140.33,82.55 U$9.8 v142.87,82.55 | 140.33,85.09 U$10.5 v142.87,85.09
  Top 1.27: C2.+ 9.52,92.08 v9.52,88.9
  Bottom 0.254: v113.02,87 114.29,88.27 v114.29,93.34 | 22.21,4.45 S1.P$3
  Bottom 1.27: S1.P$3 21.83,7.37 20.94,8.26 11.42,8.26 9.52,10.16 v9.52,12.7 v9.52,16.51 v9.52,19.05 v9.52,22.86 v9.52,29.21 v9.52,33.02 v9.52,35.56 v9.52,39.37 v9.52,45.72 v9.52,49.53 v9.52,52.07 v9.52,55.88 v9.52,62.23 v9.52,66.04 v9.52,68.58 v9.52,72.39 v9.52,78.74 v9.52,82.55 v9.52,85.09 v9.52,88.9 | 22.21,4.45 46.34,4.45 48.25,2.54 90.16,2.54 96.51,8.89 104.77,8.89 111.11,2.54 137.15,2.54 142.87,8.26 v142.87,12.7 v142.87,16.51 v142.87,19.05 v142.87,22.86 v142.87,29.21 v142.87,33.02 v142.87,35.56 v142.87,39.37 v142.87,45.72 v142.87,49.53 v142.87,52.07 v142.87,55.88 v142.87,62.23 v142.87,66.04 v142.87,68.58 v142.87,72.39 v142.87,78.74 v142.87,82.55 v142.87,85.09 v142.87,88.9 136.52,95.25 C3.+
XRESET  (via drill 0.61)
  Top 0.254: v71.11,89.53 71.74,88.9 91.43,88.9 U1.53
  Bottom 0.254: v71.11,89.53 71.11,96.52 59.05,96.52 34.91,72.39 34.91,58.42 24.75,48.26 XB1.5